# EAGLE design haptic-control (EAGLE 9.3.2)
COMPANY: Tech4Home; CREVISION: v0.1; DESIGNER: Rafael Silva, Joao Silva; LICENSE: Copyright © 2019 Tech4Home; LINK: This file can not be copied and/or distributed without express permission

## Sheet 1 of 4: Power
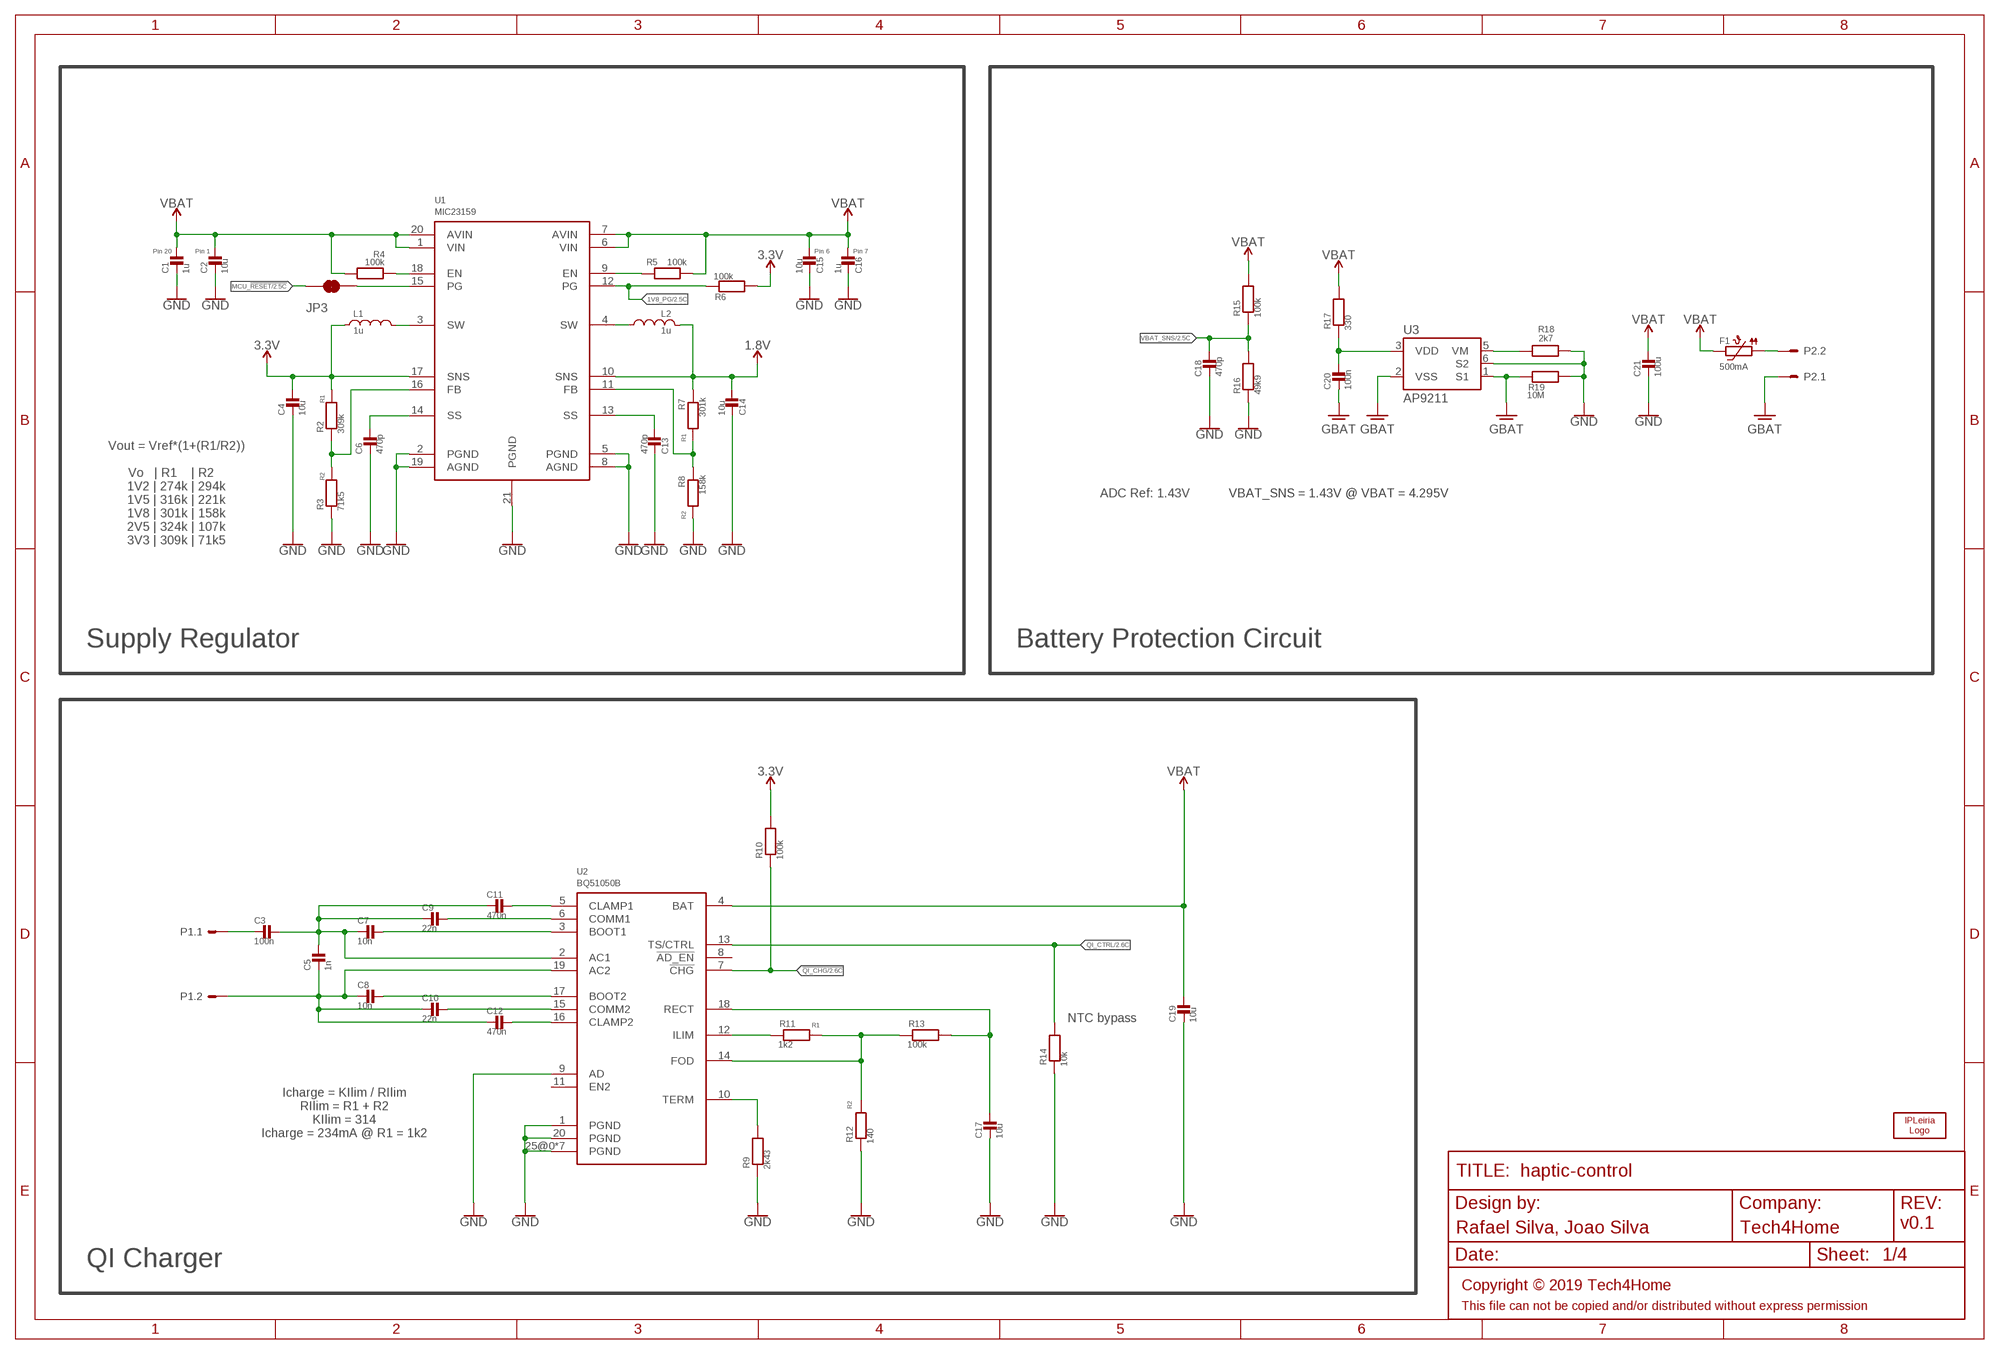
[diagram p0: schematic, sheet 1]

### Parts
C1  1u  MLCC0603  [0603_WAVE]
C2  10u  MLCC0603  [0603_WAVE]
C3  100n  MLCC_0402  [_0402]
C4  10u  MLCC0603  [0603_WAVE]
C5  1n  MLCC_0402  [_0402]
C6  470p  MLCC_0402  [_0402]
C7  10n  MLCC_0402  [_0402]
C8  10n  MLCC_0402  [_0402]
C9  22n  MLCC_0402  [_0402]
C10  22n  MLCC_0402  [_0402]
C11  470n  MLCC_0402  [_0402]
C12  470n  MLCC_0402  [_0402]
C13  470p  MLCC_0402  [_0402]
C14  10u  MLCC0603  [0603_WAVE]
C15  10u  MLCC0603  [0603_WAVE]
C16  1u  MLCC0603  [0603_WAVE]
C17  10u  MLCC0603  [0603_WAVE]
C18  470p  MLCC_0402  [_0402]
C19  10u  MLCC0603  [0603_WAVE]
C20  100n  MLCC_0402  [_0402]
C21  100u  MLCC_1206  [_1206]
F1  500mA  PTC0805  [0805]
JP3  JUMPER-SMT_2_NC_TRACE_SILK  [SMT-JUMPER_2_NC_TRACE_SILK]
L1  1u  INDUCTOR_NC_0806  [_0806]
L2  1u  INDUCTOR_NC_0806  [_0806]
LOGO1  IPL-10MM  [IPL_10MM]
P1  2P-PAD_1X3.5  [PAD1X3_5MM-2P]
P2  2P-PAD_1X3.5  [PAD1X3_5MM-2P]
R2  309k  RESISTOR_0402  [_0402]
R3  71k5  RESISTOR_0402  [_0402]
R4  100k  RESISTOR_0402  [_0402]
R5  100k  RESISTOR_0402  [_0402]
R6  100k  RESISTOR_0402  [_0402]
R7  301k  RESISTOR_0402  [_0402]
R8  158k  RESISTOR_0402  [_0402]
R9  2k43  RESISTOR_0402  [_0402]
R10  100k  RESISTOR_0402  [_0402]
R11  1k2  RESISTOR_0402  [_0402]
R12  140  RESISTOR_0402  [_0402]
R13  100k  RESISTOR_0402  [_0402]
R14  10k  RESISTOR_0402  [_0402]
R15  100k  RESISTOR_0402  [_0402]
R16  49k9  RESISTOR_0402  [_0402]
R17  330  RESISTOR_0402  [_0402]
R18  2k7  RESISTOR_0402  [_0402]
R19  10M  RESISTOR_0402  [_0402]
U1  MIC23159  [VQFN20]
U2  BQ51050B  [VQFN20]
U3  AP9211  [DFN2030-6]

### Nets
1.8V: C14.P$1 L2.1 R7.1 U1.10(SNS) ; also sheet 3
1V8_PG: R6.1 U1.12(PG) ; also sheet 2
3.3V: C4.P$1 L1.1 R2.2 R6.2 R10.2 U1.17(SNS) ; also sheet 2,3,4
!QI_CHG: R10.1 U2.7(!CHG) ; also sheet 2
GBAT: C20.2 P2.1 R19.1 U3.1(S1) U3.2(VSS)
GND: C1.P$2 C2.P$2 C4.P$2 C6.2 C13.2 C14.P$2 C15.P$2 C16.P$2 C17.P$2 C18.2 C19.P$2 C21.2 R3.1 R8.2 R9.1 R12.1 R14.1 R16.1 R18.1 R19.2 U1.2(PGND) U1.5(PGND) U1.8(AGND) U1.19(AGND) U1.21(PGND) U2.1(PGND) U2.9(AD) U2.20(PGND) U2.25@0(PGND) U2.25@1(PGND) U2.25@2(PGND) U2.25@3(PGND) U2.25@4(PGND) U2.25@5(PGND) U2.25@6(PGND) U3.6(S2) ; also sheet 2,3,4
MCU_!RESET: JP3.1 ; also sheet 2
MPU_PWR: R5.1 U1.9(EN)
N$21: R18.2 U3.5(VM)
N$22: F1.1 P2.2
N$23: C20.1 R17.1 U3.3(VDD)
N$25: R2.1 R3.2 U1.16(FB)
N$26: R4.1 U1.18(EN)
N$28: L1.2 U1.3(SW)
N$29: C6.1 U1.14(SS)
N$30: L2.2 U1.4(SW)
N$31: C13.1 U1.13(SS)
N$32: R7.2 R8.1 U1.11(FB)
N$39: R11.2 R12.2 R13.1 U2.14(FOD)
N$40: R11.1 U2.12(ILIM)
N$41: C17.P$1 R13.2 U2.18(RECT)
N$42: R9.2 U2.10(TERM)
N$43: C11.1 U2.5(CLAMP1)
N$44: C9.1 U2.6(COMM1)
N$45: C7.1 U2.3(BOOT1)
N$46: C12.1 U2.16(CLAMP2)
N$47: C10.1 U2.15(COMM2)
N$48: C8.1 U2.17(BOOT2)
N$49: C5.2 C8.2 C10.2 C12.2 P1.2 U2.19(AC2)
N$50: C3.1 C5.1 C7.2 C9.2 C11.2 U2.2(AC1)
N$51: C3.2 P1.1
N$53: JP3.2 U1.15(PG)
QI_CTRL: R14.2 U2.13(TS/CTRL) ; also sheet 2
VBAT: C1.P$1 C2.P$1 C15.P$1 C16.P$1 C19.P$1 C21.1 F1.2 R4.2 R5.2 R15.2 R17.2 U1.1(VIN) U1.6(VIN) U1.7(AVIN) U1.20(AVIN) U2.4(BAT) ; also sheet 4
VBAT_SNS: C18.1 R15.1 R16.2 ; also sheet 2
Unconnected: U2.8(!AD_EN) U2.11(EN2)

### Notes on the sheet
- Pin 20 | Pin 1 | Pin 6 | Pin 7
- R1
- R1
- R2
- Vout = Vref*(1+(R1/R2))
  
   Vo   | R1    | R2    
  1V2 | 274k | 294k
  1V5 | 316k | 221k
  1V8 | 301k | 158k
  2V5 | 324k | 107k
  3V3 | 309k | 71k5
- ADC Ref: 1.43V | VBAT_SNS = 1.43V @ VBAT = 4.295V
- R2
- Supply Regulator | Battery Protection Circuit
- NTC bypass
- R1
- R2
- Icharge = KIlim / RIlim
  RIlim = R1 + R2
  KIlim = 314
  Icharge = 234mA @ R1 = 1k2
- QI Charger

## Sheet 2 of 4: MCU
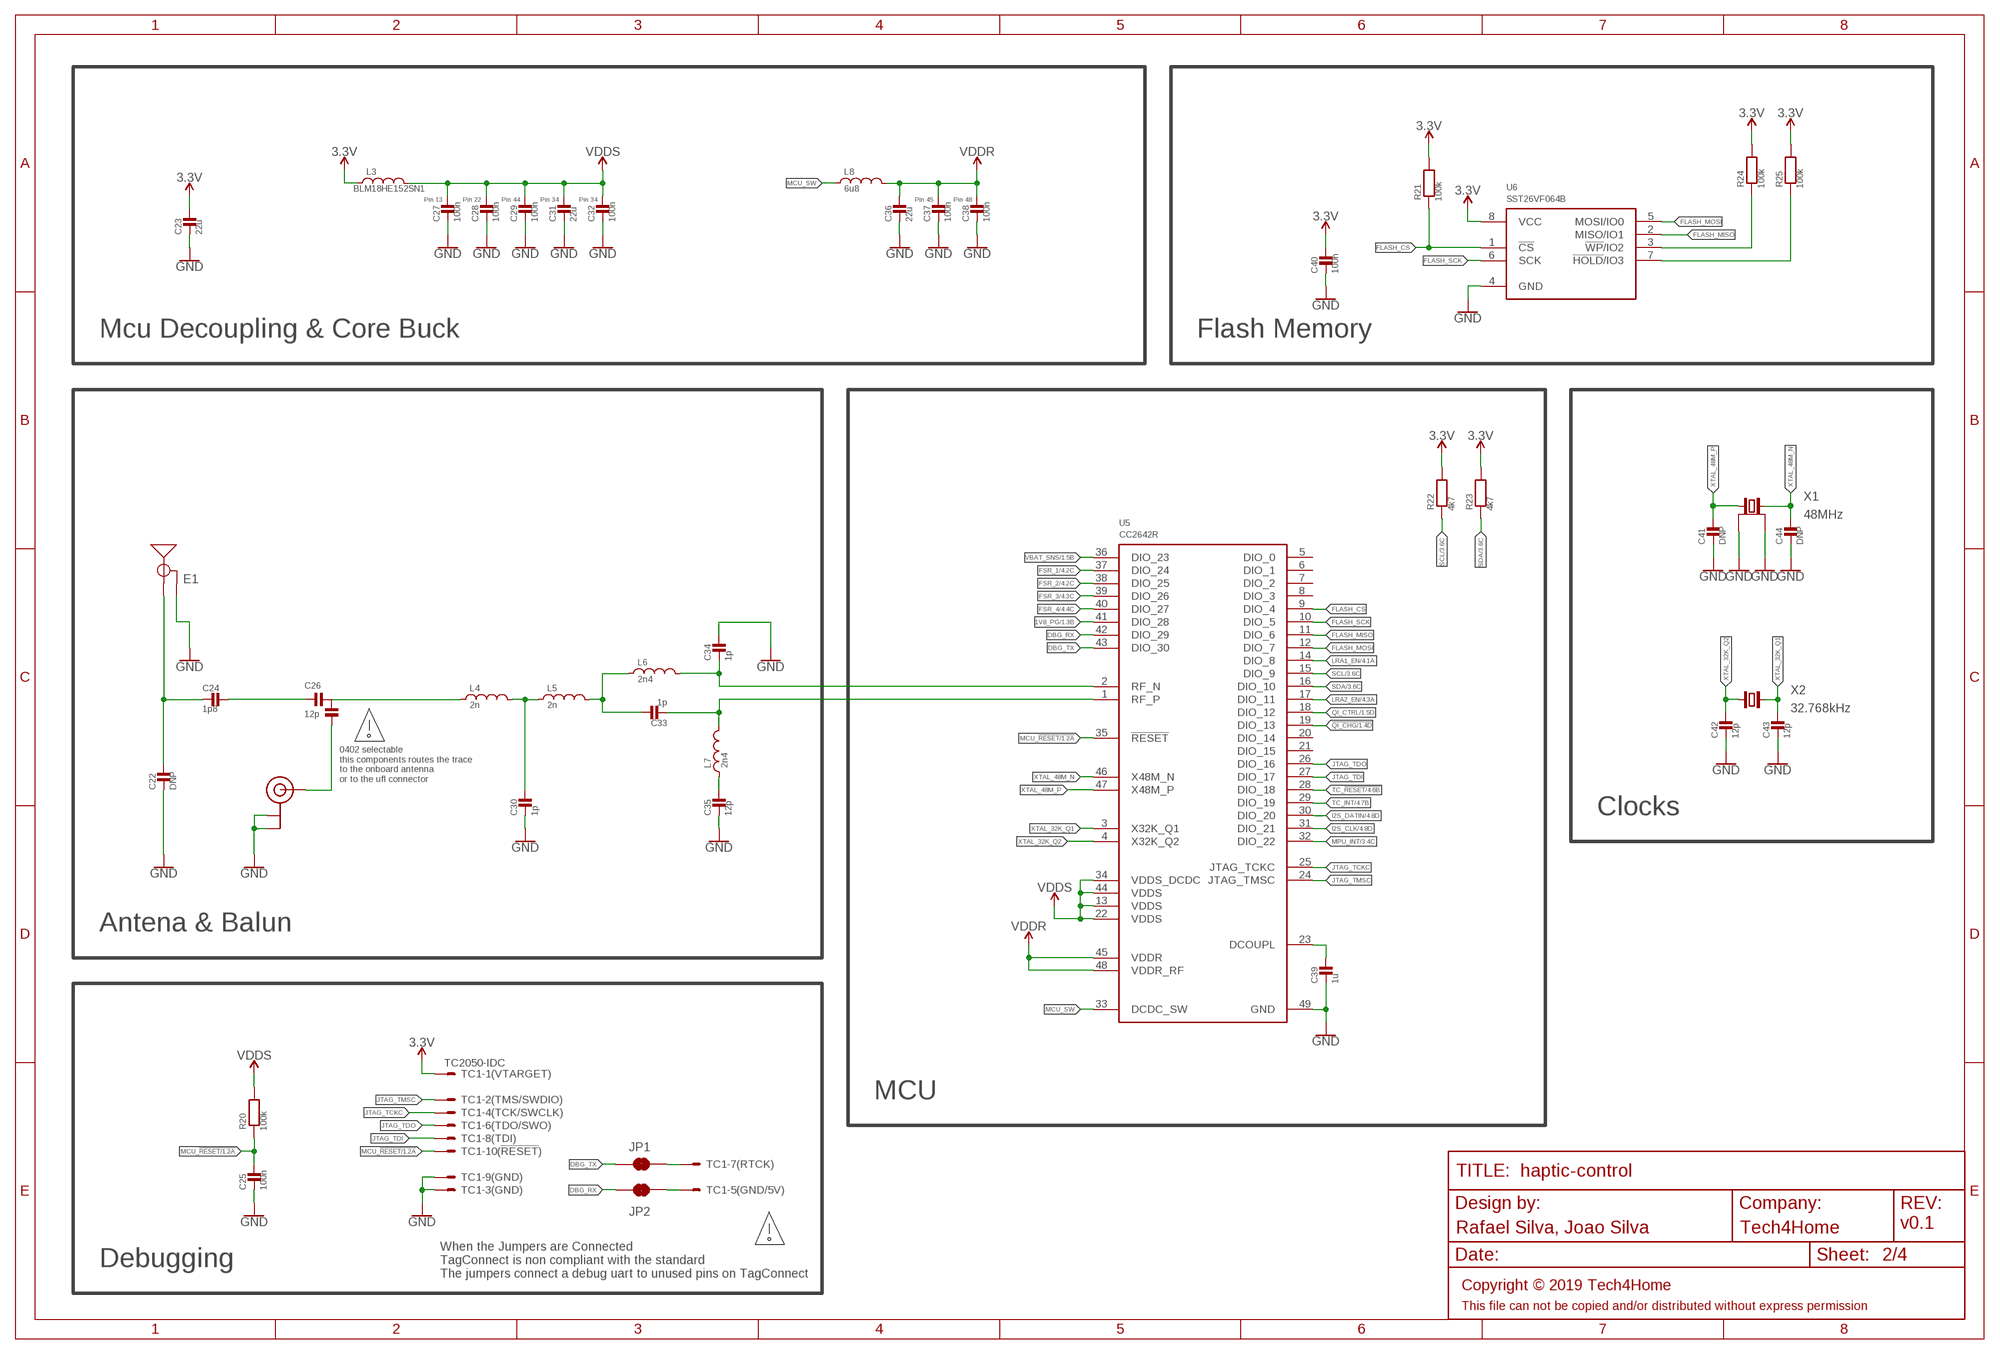
[diagram p1: schematic, sheet 2]

### Parts
A1  U.FL  [U.FL]
C22  DNP  MLCC_0402  [_0402]
C23  22u  MLCC0603  [0603_WAVE]
C24  1p8  MLCC_0402  [_0402]
C25  100n  MLCC_0402  [_0402]
C26  12p  MLCC_SEL  [_0402_SEL]
C27  100n  MLCC_0402  [_0402]
C28  100n  MLCC_0402  [_0402]
C29  100n  MLCC_0402  [_0402]
C30  1p  MLCC_0402  [_0402]
C31  22u  MLCC0603  [0603_WAVE]
C32  100n  MLCC_0402  [_0402]
C33  1p  MLCC_0402  [_0402]
C34  1p  MLCC_0402  [_0402]
C35  12p  MLCC_0402  [_0402]
C36  22u  MLCC0603  [0603_WAVE]
C37  100n  MLCC_0402  [_0402]
C38  100n  MLCC_0402  [_0402]
C39  1u  MLCC0603  [0603_WAVE]
C40  100n  MLCC_0402  [_0402]
C41  DNP  MLCC_0402  [_0402]
C42  12p  MLCC_0402  [_0402]
C43  12p  MLCC_0402  [_0402]
C44  DNP  MLCC_0402  [_0402]
E1  2.4GHZTRACE-15.2MM  [TRACE_ANTENNA_2.4GHZ_15.2MM]
JP1  JUMPER-SMT_2_NC_TRACE_SILK  [SMT-JUMPER_2_NC_TRACE_SILK]
JP2  JUMPER-SMT_2_NC_TRACE_SILK  [SMT-JUMPER_2_NC_TRACE_SILK]
L3  BLM18HE152SN1  INDUCTOR_NC_0603  [_0603]
L4  2n  INDUCTOR_NC_0402  [_0402]
L5  2n  INDUCTOR_NC_0402  [_0402]
L6  2n4  INDUCTOR_NC_0402  [_0402]
L7  2n4  INDUCTOR_NC_0402  [_0402]
L8  6u8  INDUCTOR_NC_0806  [_0806]
R20  100k  RESISTOR_0402  [_0402]
R21  100k  RESISTOR_0402  [_0402]
R22  4k7  RESISTOR_0402  [_0402]
R23  4k7  RESISTOR_0402  [_0402]
R24  100k  RESISTOR_0402  [_0402]
R25  100k  RESISTOR_0402  [_0402]
TC1  TC2050-IDC  [TC2050-IDC]
U5  CC2642R  [QFN48]
U6  SST26VF064B  [WSOIC8]
X1  48MHz  CRYSTAL_4P  [4-SMD-3225]
X2  32.768kHz  CRYSTAL2-SMD-3215  [2-SMD-3215]

### Nets
1V8_PG: U5.41(DIO_28) ; also sheet 1
3.3V: C23.P$1 C40.1 L3.1 R21.2 R22.2 R23.2 R24.2 R25.2 TC1.1 U6.8(VCC) ; also sheet 1,3,4
!QI_CHG: U5.19(DIO_13) ; also sheet 1
DBG_RX: JP2.1 U5.42(DIO_29)
DBG_TX: JP1.1 U5.43(DIO_30)
FLASH_CS: R21.1 U5.9(DIO_4) U6.1(!CS!)
FLASH_MISO: U5.11(DIO_6) U6.2(MISO/IO1)
FLASH_MOSI: U5.12(DIO_7) U6.5(MOSI/IO0)
FLASH_SCK: U5.10(DIO_5) U6.6(SCK)
FSR_1: U5.37(DIO_24) ; also sheet 4
FSR_2: U5.38(DIO_25) ; also sheet 4
FSR_3: U5.39(DIO_26) ; also sheet 4
FSR_4: U5.40(DIO_27) ; also sheet 4
GND: A1.P$1(GND) A1.P$2(GND) C22.2 C23.P$2 C25.2 C27.2 C28.2 C29.2 C30.2 C31.P$2 C32.2 C34.1 C35.2 C36.P$2 C37.2 C38.2 C39.P$2 C40.2 C41.2 C42.2 C43.2 C44.2 E1.GND TC1.3 TC1.9 U5.49(GND) U6.4(GND) X1.2(GND) X1.4(GND) ; also sheet 1,3,4
I2S_CLK: U5.31(DIO_21) ; also sheet 4
I2S_DATIN: U5.30(DIO_20) ; also sheet 4
JTAG_TCKC: TC1.4 U5.25(JTAG_TCKC)
JTAG_TDI: TC1.8 U5.27(DIO_17)
JTAG_TDO: TC1.6 U5.26(DIO_16)
JTAG_TMSC: TC1.2 U5.24(JTAG_TMSC)
LRA1_EN: U5.14(DIO_8) ; also sheet 4
LRA2_EN: U5.17(DIO_11) ; also sheet 4
MCU_!RESET: C25.1 R20.1 TC1.10 U5.35(!RESET) ; also sheet 1
MCU_SW: L8.1 U5.33(DCDC_SW)
MPU_INT: U5.32(DIO_22) ; also sheet 3
N$1: C34.2 L6.2 U5.2(RF_N)
N$2: C39.P$1 U5.23(DCOUPL)
N$3: C33.2 L7.2 U5.1(RF_P)
N$7: R24.1 U6.3(!WP!/IO2)
N$8: R25.1 U6.7(!HOLD!/IO3)
N$12: C26.1(I) L4.1
N$13: C24.1 C26.3(O2)
N$14: C35.1 L7.1
N$15: C33.1 L5.2 L6.1
N$16: C30.1 L4.2 L5.1
N$17: C22.1 C24.2 E1.ANT(SIGNAL)
N$18: A1.P$3(SIGNAL) C26.2(O1)
N$19: JP2.2 TC1.5
N$20: JP1.2 TC1.7
QI_CTRL: U5.18(DIO_12) ; also sheet 1
SCL: R22.1 U5.15(DIO_9) ; also sheet 3,4
SDA: R23.1 U5.16(DIO_10) ; also sheet 3,4
TC_!RESET: U5.28(DIO_18) ; also sheet 4
TC_INT: U5.29(DIO_19) ; also sheet 4
VBAT_SNS: U5.36(DIO_23) ; also sheet 1
VDDR: C36.P$1 C37.1 C38.1 L8.2 U5.45(VDDR) U5.48(VDDR_RF)
VDDS: C27.1 C28.1 C29.1 C31.P$1 C32.1 L3.2 R20.2 U5.13(VDDS) U5.22(VDDS) U5.34(VDDS_DCDC) U5.44(VDDS)
XTAL_32K_Q1: C43.1 U5.3(X32K_Q1) X2.2
XTAL_32K_Q2: C42.1 U5.4(X32K_Q2) X2.1
XTAL_48M_N: C44.1 U5.46(X48M_N) X1.3
XTAL_48M_P: C41.1 U5.47(X48M_P) X1.1
Unconnected: U5.5(DIO_0) U5.6(DIO_1) U5.7(DIO_2) U5.8(DIO_3) U5.20(DIO_14) U5.21(DIO_15)

### Notes on the sheet
- Pin 13 | Pin 22 | Pin 44 | Pin 34 | Pin 34 | Pin 45 | Pin 48
- Mcu Decoupling & Core Buck | Flash Memory
- 0402 selectable
  this components routes the trace 
  to the onboard antenna 
  or to the ufl connector
- Clocks
- Antena & Balun
- MCU
- Debugging
- When the Jumpers are Connected
  TagConnect is non compliant with the standard
  The jumpers connect a debug uart to unused pins on TagConnect

## Sheet 3 of 4: MPU
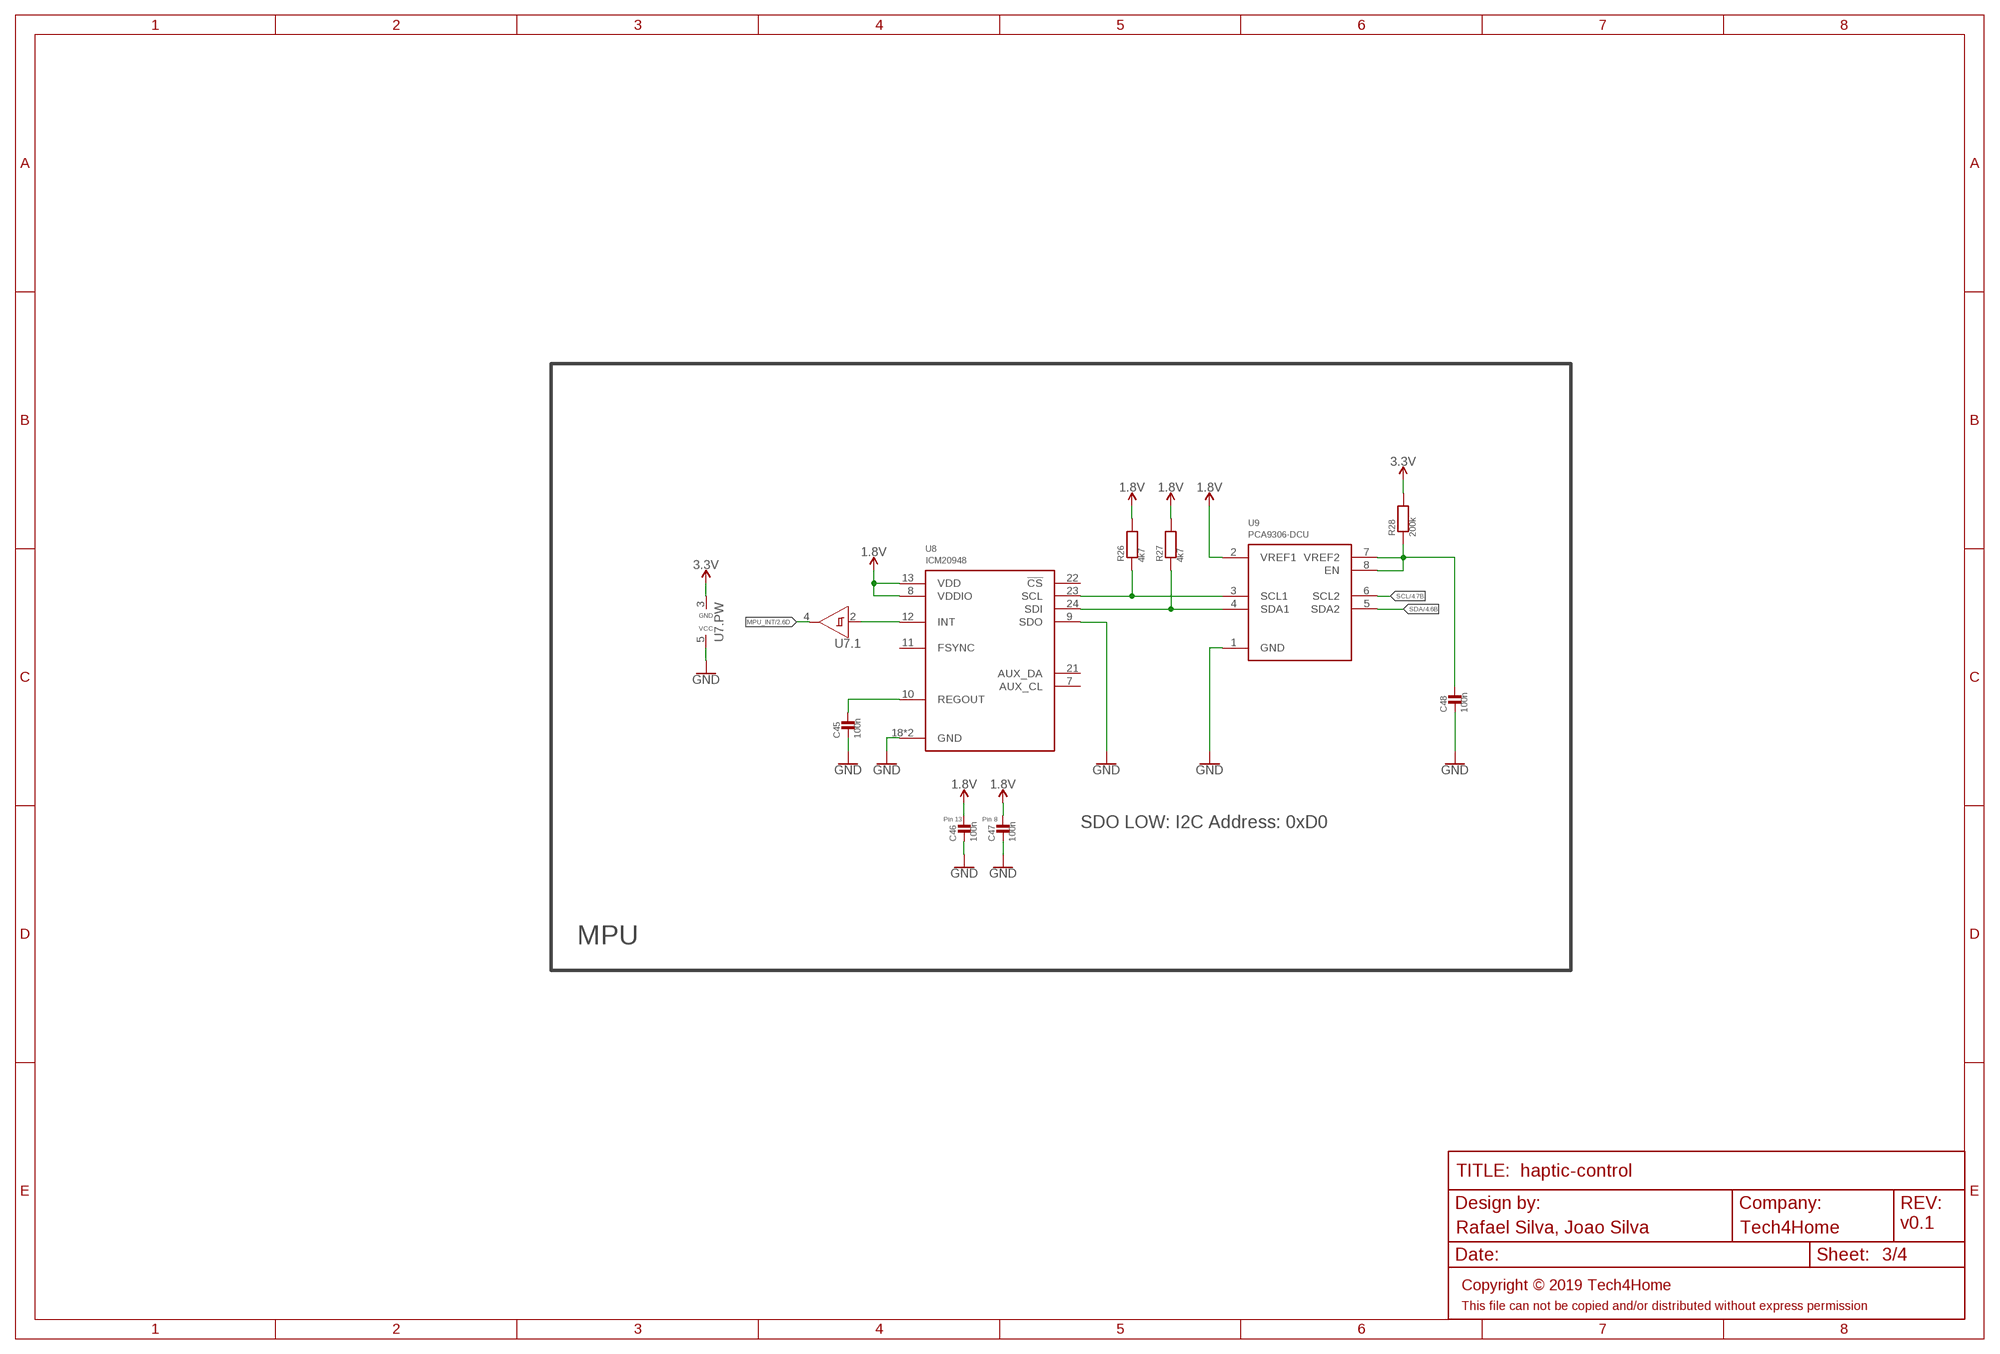
[diagram p2: schematic, sheet 3]

### Parts
C45  100n  MLCC_0402  [_0402]
C46  100n  MLCC_0402  [_0402]
C47  100n  MLCC_0402  [_0402]
C48  100n  MLCC_0402  [_0402]
R26  4k7  RESISTOR_0402  [_0402]
R27  4k7  RESISTOR_0402  [_0402]
R28  200k  RESISTOR_0402  [_0402]
U7  74LVC1G17  [SC70-5]
U8  ICM20948  [QFN20]
U9  PCA9306-DCU  [VSSOP8]

### Nets
1.8V: C46.1 C47.1 R26.2 R27.2 U8.8(VDDIO) U8.13(VDD) U9.2(VREF1) ; also sheet 1
3.3V: R28.2 U7.3(.PW:GND) ; also sheet 1,2,4
GND: C45.2 C46.2 C47.2 C48.2 U7.5(.PW:VCC) U8.9(SDO) U8.18(GND) U8.20(GND) U9.1(GND) ; also sheet 1,2,4
MPU_INT: U7.4(.1:Y) ; also sheet 2
N$4: U7.2(.1:A) U8.12(INT)
N$5: R26.1 U8.23(SCL) U9.3(SCL1)
N$6: R27.1 U8.24(SDI) U9.4(SDA1)
N$9: C45.1 U8.10(REGOUT)
N$11: C48.1 R28.1 U9.7(VREF2) U9.8(EN)
SCL: U9.6(SCL2) ; also sheet 2,4
SDA: U9.5(SDA2) ; also sheet 2,4
Unconnected: U8.7(AUX_CL) U8.11(FSYNC) U8.21(AUX_DA) U8.22(!CS)

### Notes on the sheet
- Pin 13 | Pin 8
- SDO LOW: I2C Address: 0xD0
- MPU

## Sheet 4 of 4: Interface
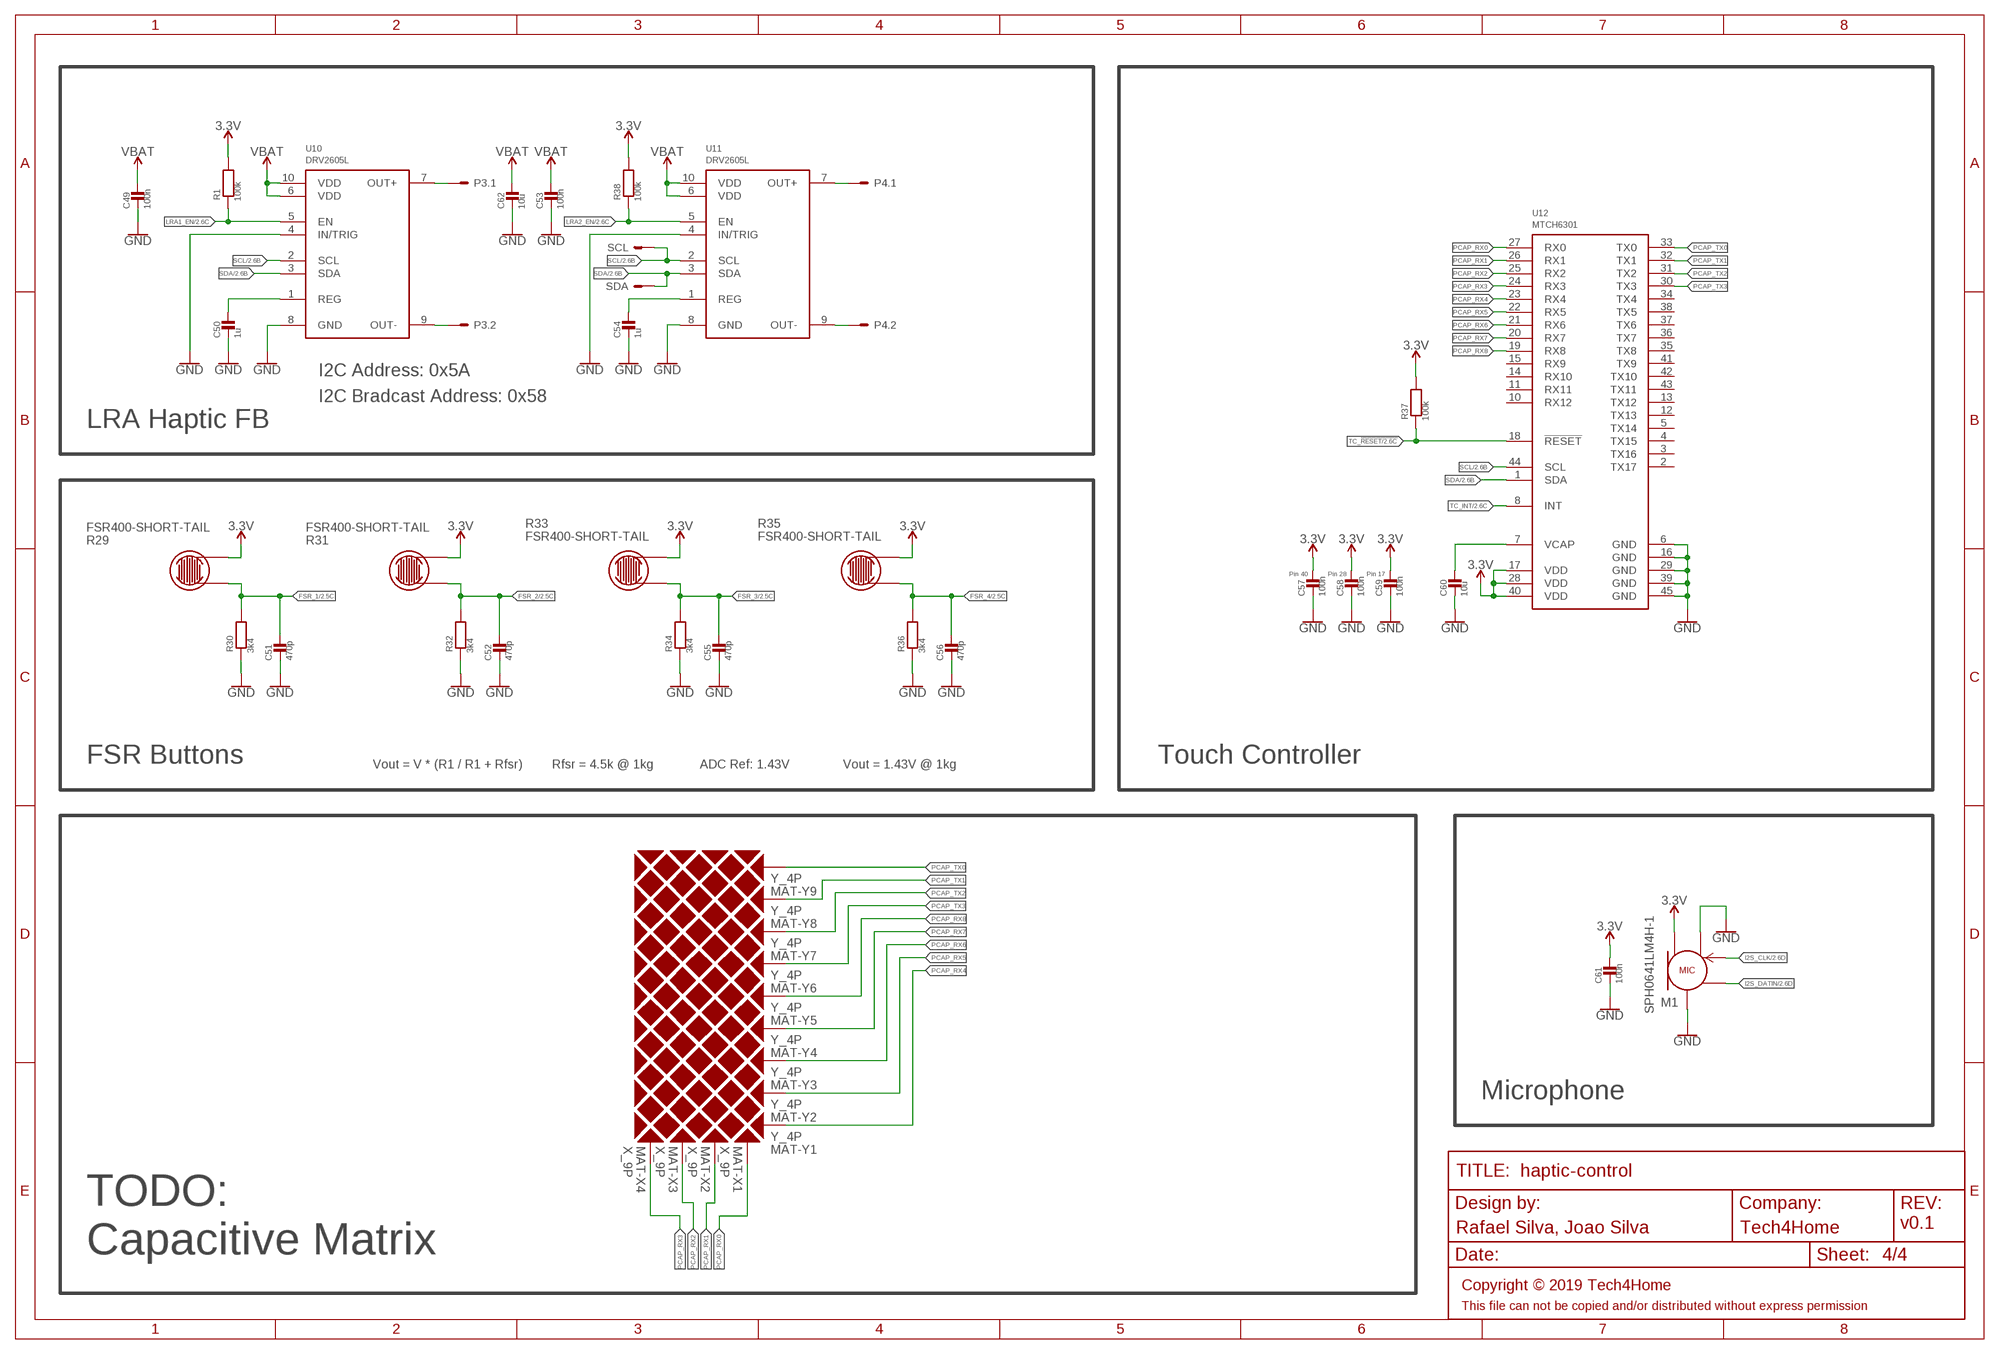
[diagram p3: schematic, sheet 4]

### Parts
C49  100n  MLCC_0402  [_0402]
C50  1u  MLCC0603  [0603_WAVE]
C51  470p  MLCC_0402  [_0402]
C52  470p  MLCC_0402  [_0402]
C53  100n  MLCC_0402  [_0402]
C54  1u  MLCC0603  [0603_WAVE]
C55  470p  MLCC_0402  [_0402]
C56  470p  MLCC_0402  [_0402]
C57  100n  MLCC_0402  [_0402]
C58  100n  MLCC_0402  [_0402]
C59  100n  MLCC_0402  [_0402]
C60  10u  MLCC0603  [0603_WAVE]
C61  100n  MLCC_0402  [_0402]
C62  10u  MLCC0603  [0603_WAVE]
M1  SPH0641LM4H-1  [SPH0641LM4H-1]
MAT-X1  X_9P  [TOUCH_X_9P]
MAT-X2  X_9P  [TOUCH_X_9P]
MAT-X3  X_9P  [TOUCH_X_9P]
MAT-X4  X_9P  [TOUCH_X_9P]
MAT-Y1  Y_4P  [TOUCH_Y_4P]
MAT-Y2  Y_4P  [TOUCH_Y_4P]
MAT-Y3  Y_4P  [TOUCH_Y_4P]
MAT-Y4  Y_4P  [TOUCH_Y_4P]
MAT-Y5  Y_4P  [TOUCH_Y_4P]
MAT-Y6  Y_4P  [TOUCH_Y_4P]
MAT-Y7  Y_4P  [TOUCH_Y_4P]
MAT-Y8  Y_4P  [TOUCH_Y_4P]
MAT-Y9  Y_4P  [TOUCH_Y_4P]
P3  2P-PAD_1X3.5  [PAD1X3_5MM-2P]
P4  2P-PAD_1X3.5  [PAD1X3_5MM-2P]
R1  100k  RESISTOR_0402  [_0402]
R29  FSR400-SHORT-TAIL  [FSR400-SHORT-TAIL]
R30  3k4  RESISTOR_0402  [_0402]
R31  FSR400-SHORT-TAIL  [FSR400-SHORT-TAIL]
R32  3k4  RESISTOR_0402  [_0402]
R33  FSR400-SHORT-TAIL  [FSR400-SHORT-TAIL]
R34  3k4  RESISTOR_0402  [_0402]
R35  FSR400-SHORT-TAIL  [FSR400-SHORT-TAIL]
R36  3k4  RESISTOR_0402  [_0402]
R37  100k  RESISTOR_0402  [_0402]
R38  100k  RESISTOR_0402  [_0402]
SCL  TEST_POINT  [TEST_POINT]
SDA  TEST_POINT  [TEST_POINT]
U10  DRV2605L  [VSSOP10]
U11  DRV2605L  [VSSOP10]
U12  MTCH6301  [QFN44]

### Nets
3.3V: C57.1 C58.1 C59.1 C61.1 M1.5(VCC) R1.2 R29.2 R31.2 R33.1 R35.1 R37.2 R38.2 U12.17(VDD) U12.28(VDD) U12.40(VDD) ; also sheet 1,2,3
FSR_1: C51.1 R29.1 R30.2 ; also sheet 2
FSR_2: C52.1 R31.1 R32.2 ; also sheet 2
FSR_3: C55.1 R33.2 R34.2 ; also sheet 2
FSR_4: C56.1 R35.2 R36.2 ; also sheet 2
GND: C49.2 C50.P$2 C51.2 C52.2 C53.2 C54.P$2 C55.2 C56.2 C57.2 C58.2 C59.2 C60.P$2 C61.2 C62.P$2 M1.2(SEL) M1.3(GND) R30.1 R32.1 R34.1 R36.1 U10.4(IN/TRIG) U10.8(GND) U11.4(IN/TRIG) U11.8(GND) U12.6(GND) U12.16(GND) U12.29(GND) U12.39(GND) U12.45(GND) ; also sheet 1,2,3
I2S_CLK: M1.4(CLK) ; also sheet 2
I2S_DATIN: M1.1(DAT) ; also sheet 2
LRA1_EN: R1.1 U10.5(EN) ; also sheet 2
LRA2_EN: R38.1 U11.5(EN) ; also sheet 2
N$10: C60.P$1 U12.7(VCAP)
N$27: P3.1 U10.7(OUT+)
N$33: P3.2 U10.9(OUT-)
N$34: P4.1 U11.7(OUT+)
N$35: P4.2 U11.9(OUT-)
N$36: C50.P$1 U10.1(REG)
N$37: C54.P$1 U11.1(REG)
PCAP_RX0: MAT-X1.P$2 U12.27(RX0)
PCAP_RX1: MAT-X2.P$2 U12.26(RX1)
PCAP_RX2: MAT-X3.P$2 U12.25(RX2)
PCAP_RX3: MAT-X4.P$2 U12.24(RX3)
PCAP_RX4: MAT-Y1.P$2 MAT-Y1.P$3 MAT-Y1.P$4 MAT-Y1.P$5 MAT-Y1.P$8 U12.23(RX4)
PCAP_RX5: MAT-Y2.P$2 MAT-Y2.P$3 MAT-Y2.P$4 MAT-Y2.P$5 MAT-Y2.P$8 U12.22(RX5)
PCAP_RX6: MAT-Y3.P$2 MAT-Y3.P$3 MAT-Y3.P$4 MAT-Y3.P$5 MAT-Y3.P$8 U12.21(RX6)
PCAP_RX7: MAT-Y4.P$2 MAT-Y4.P$3 MAT-Y4.P$4 MAT-Y4.P$5 MAT-Y4.P$8 U12.20(RX7)
PCAP_RX8: MAT-Y5.P$2 MAT-Y5.P$3 MAT-Y5.P$4 MAT-Y5.P$5 MAT-Y5.P$8 U12.19(RX8)
PCAP_TX0: MAT-Y9.P$2 MAT-Y9.P$3 MAT-Y9.P$4 MAT-Y9.P$5 MAT-Y9.P$8 U12.33(TX0)
PCAP_TX1: MAT-Y8.P$2 MAT-Y8.P$3 MAT-Y8.P$4 MAT-Y8.P$5 MAT-Y8.P$8 U12.32(TX1)
PCAP_TX2: MAT-Y7.P$2 MAT-Y7.P$3 MAT-Y7.P$4 MAT-Y7.P$5 MAT-Y7.P$8 U12.31(TX2)
PCAP_TX3: MAT-Y6.P$2 MAT-Y6.P$3 MAT-Y6.P$4 MAT-Y6.P$5 MAT-Y6.P$8 U12.30(TX3)
SCL: SCL.1(S) U10.2(SCL) U11.2(SCL) U12.44(SCL) ; also sheet 2,3
SDA: SDA.1(S) U10.3(SDA) U11.3(SDA) U12.1(SDA) ; also sheet 2,3
TC_!RESET: R37.1 U12.18(!RESET) ; also sheet 2
TC_INT: U12.8(INT) ; also sheet 2
VBAT: C49.1 C53.1 C62.P$1 U10.6(VDD) U10.10(VDD) U11.6(VDD) U11.10(VDD) ; also sheet 1
Unconnected: U12.2(TX17) U12.3(TX16) U12.4(TX15) U12.5(TX14) U12.10(RX12) U12.11(RX11) U12.12(TX13) U12.13(TX12) U12.14(RX10) U12.15(RX9) U12.34(TX4) U12.35(TX8) U12.36(TX7) U12.37(TX6) U12.38(TX5) U12.41(TX9) U12.42(TX10) U12.43(TX11)

### Notes on the sheet
- I2C Address: 0x5A
- I2C Bradcast Address: 0x58
- LRA Haptic FB
- Pin 40 | Pin 28 | Pin 17
- FSR Buttons | Vout = V * (R1 / R1 + Rfsr) | Rfsr = 4.5k @ 1kg | ADC Ref: 1.43V | Vout = 1.43V @ 1kg | Touch Controller
- Microphone
- TODO:
  Capacitive Matrix

## Library data of the parts
A1 = Connectors > Antennas:U.FL
C1-C25 C27-C62 = Passive Components > Capacitors > Multilayer Ceramic Capacitors MLCC:MLCC: KEMET’s X7R dielectric features a 125°C maximum operating temperature and is considered temperature stable. The Electronics Components, Assemblies and Materials Association (EIA) characterizes X7R dielectric as a Class II material. Components of this classification are fixed, ceramic dielectric capacitors suited for bypass and decoupling applications or for frequency discriminating circuits where Q and stability of capacitance characteristics are not critical. X7R exhibits a predictable change in capacitance with respect to time and voltage, boasting a minimal change in capacitance with reference to ambient temperature. Capacitance change is limited to ±15% from −55°C to +125°C.
C26 = Passive Components > Capacitors > Multilayer Ceramic Capacitors MLCC:MLCC_SEL
E1 = Microstrip Antenna:2.4GHZ: Chip antenna Chip antenna with ground or secondary connection. Common with larger metal RF connectors.
F1 = PTC Fuses:PTC
JP1-JP3 = Utility > Board:JUMPER-SMT_2_NC_TRACE: Normally closed trace jumper This jumper has a trace between two pads so it's normally closed (NC). Use a razor knife to open the connection. For best results follow the IPC guidelines for cutting traces: Cutout at least 0.063 mm (0.005 in). Remove all loose material to clean up the cut area. Seal the cut with an approved epoxy. Reapply solder to reclose the connection.
L1-L8 = Passive Components > Inductors, Chokes & Coils:INDUCTOR_NC
LOGO1 = Silkscreen:IPL
M1 = Knowles:SPH0641LM4H-1
MAT-X1-MAT-X4 = Touch Panel:X_9P
MAT-Y1-MAT-Y9 = Touch Panel:Y_4P
P1-P4 = Connectors > Other:2P-PAD
R1-R28 R30 R32 R34 R36-R38 = Passive Components > Resistors > Chip Resistors:RESISTOR: Resistors For new designs, use the packages preceded by an '_' character since they are more reliable: The following footprints should be used on most boards: _0402 - Standard footprint for regular board layouts _0603 - Standard footprint for regular board layouts _0805 - Standard footprint for regular board layouts _1206 - Standard footprint for regular board layouts For extremely tight-pitch boards where space is at a premium, the following 'micro-pitch' footprints can be used (smaller pads, no silkscreen outline, etc.): _0402MP - Micro-pitch footprint for very dense/compact boards _0603MP - Micro-pitch footprint for very dense/compact boards _0805MP - Micro-pitch footprint for very dense/compact boards _1206MP - Micro-pitch footprint for very dense/compact boards
R29 R31 R33 R35 = Interlink:FSR400
SCL SDA = Utility > Board:TEST_POINT
TC1 = TagConnect:TC2050-IDC
U1 = Microchip:MIC23159
U2 = Texas Instruments:BQ51050B
U3 = Power > Battery Management:AP9211
U5 = Texas Instruments:CC2642R
U6 = Microchip:SST26VF064B
U7 = Semiconductors > Integrated Circuits - ICs > Logic ICs > Logic Gates:74LVC1G17
U8 = TDK:ICM20948
U9 = Texas Instruments:PCA9306
U10 U11 = Texas Instruments:DRV2605L
U12 = Microchip:MTCH6301
X1 = Crystal:CRYSTAL_4P
X2 = Crystal:CRYSTAL

## Board
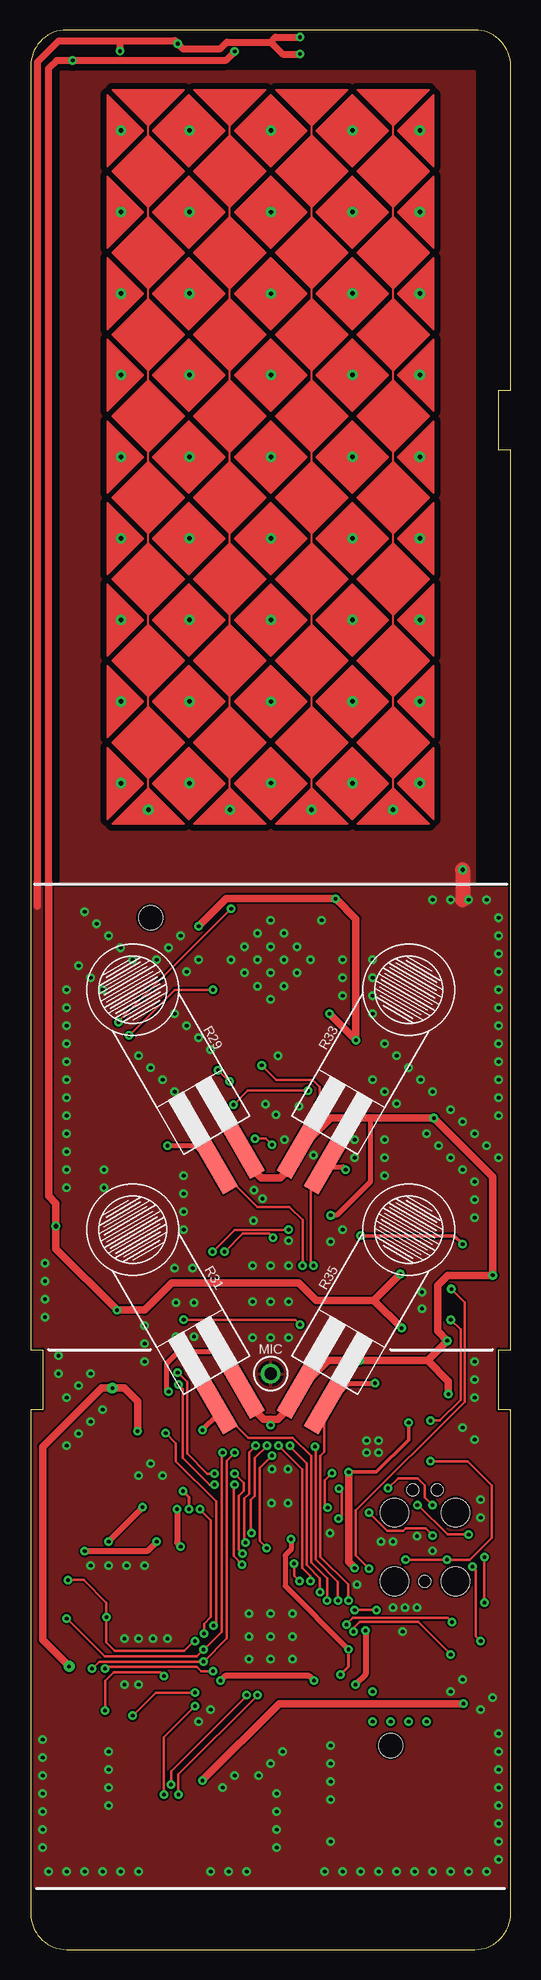
[diagram p4: board, top side]
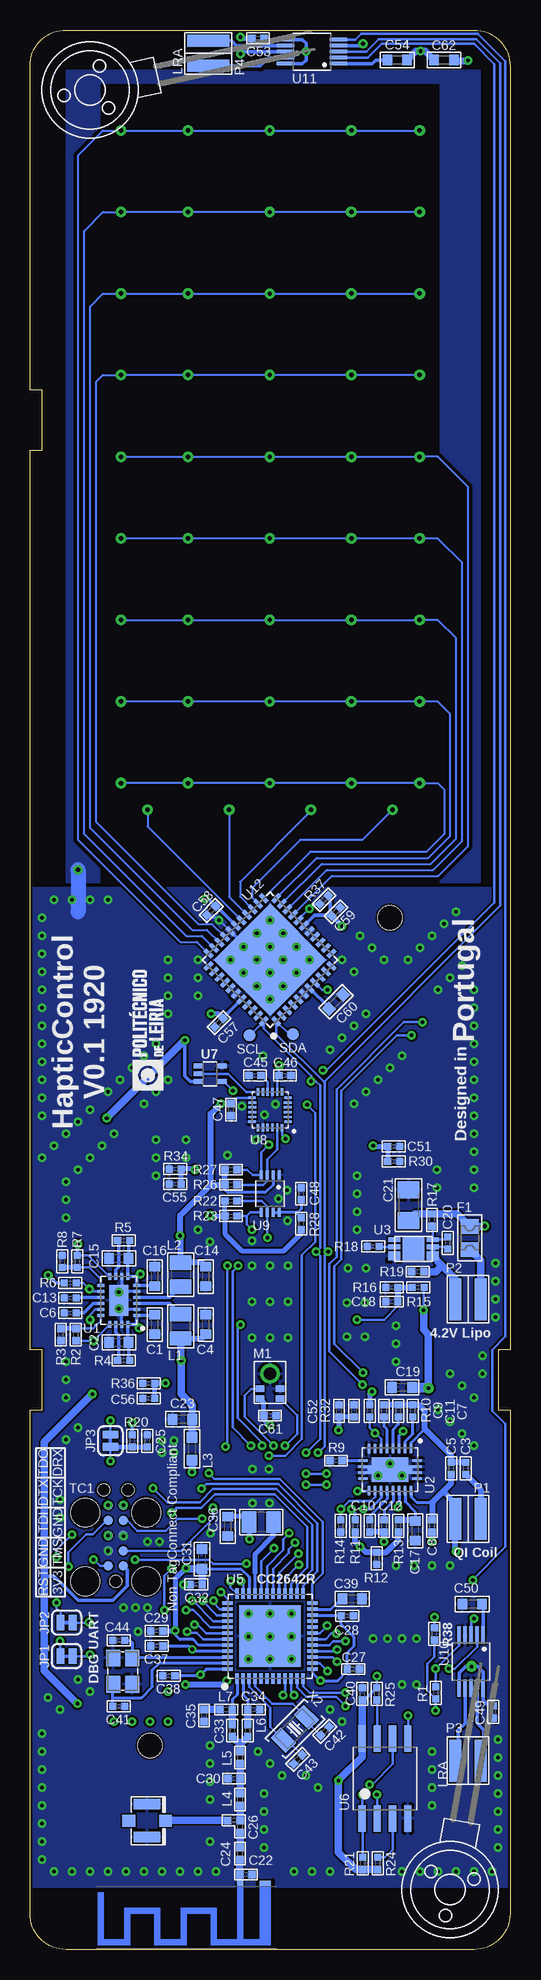
[diagram p5: board, bottom side, seen from below]

Size 40 x 160 mm. Coordinates in mm from the lower left corner, seen from the top.
Outline: 0,157 0,50 1,50 1,45 0,45 0,3 arc90 3,0 37,0 arc90 40,3 40,45 39,45 39,50 40,50 40,125 39,125 39,130 40,130 40,157 arc90 37,160 3,160 arc90 0,157
Copper layers (1*16): Top 0.035mm / dielectric 1.6mm / Bottom 0.035mm
Design rules "jlcpcb-dr *": minimum track width 5mil, minimum drill 0.3mm, track to track 5mil, track to pad 5mil, pad to pad 5mil, via to via 5mil, smd to smd 5mil, copper to edge 0.2mm, drill to drill 5mil, minimum pad ring 10mil, minimum via ring 8mil, stop-mask expansion 4mil, vias tented up to drill 0.7mm, thermal gap 10mil
Holes 2 mm at 30,17 10,86

### Footprints (pad centres in the part's own frame; a part is rotated, then mirrored left to right if it is on the bottom)
U.FL = smd 2.2 x 0.85: P$1 0,1.375; P$2 0,-1.375 | smd 1.05 x 1: P$3 1.525,0; P$4 -1.525,0
0603_WAVE = smd 0.8 x 0.9: P$1 -0.823,0; P$2 0.823,0
_0402 = smd 0.6 x 0.6: 1 -0.508,0; 2 0.508,0
_1206 = smd 1.4 x 1.8: 1 -1.27,0; 2 1.27,0
_0402_SEL = smd 0.6 x 0.6: 1 -0.508,0; 2 -0.508,-1.016; 3 0.508,0
TRACE_ANTENNA_2.4GHZ_15.2MM = smd 0.5 x 0.5: ANT 0,-0.25 | smd 0.9 x 0.5: GND -2.1,-0.25
0805 = smd 1.245 x 1.473: 1 -0.965,0; 2 0.965,0
SMT-JUMPER_2_NC_TRACE_SILK = smd 0.635 x 1.27: 1 -0.508,0; 2 0.508,0
_0806 = smd 1.2 x 1.8: 1 -1.016,0; 2 1.016,0
_0603 = smd 0.9 x 0.9: 1 -0.95,0; 2 0.95,0
SPH0641LM4H-1 = smd 0.725 x 0.522: 1 -0.838,2.074; 2 -0.838,1.252; 4 0.838,1.252; 5 0.838,2.074 | drill 1.025 pad 1.625: 3 0,0
TOUCH_X_9P = drill 0.38 pad 0.79: P$2 0,29.4
TOUCH_Y_4P = drill 0.38 pad 0.79: P$2 -12.4,0; P$3 -6.8,0; P$5 6.8,0; P$8 12.5,0 | drill 0.35 pad 0.79: P$4 0,0
PAD1X3_5MM-2P = smd 1 x 3.5: 1 -1.046,0; 2 1.046,0
FSR400-SHORT-TAIL = smd 1.4 x 4.5: 1 -1.3,-16.3; 2 1.3,-16.3
TEST_POINT = smd 1 x 1: 1 0,0
TC2050-IDC = smd 0.787 x 0.787: 1 -2.54,-0.635; 2 -1.27,-0.635; 3 0,-0.635; 4 1.27,-0.635; 5 2.54,-0.635; 6 2.54,0.635; 7 1.27,0.635; 8 0,0.635; 9 -1.27,0.635; 10 -2.54,0.635 | hole 0.991: -3.81,0; 3.81,1.016; 3.81,-1.016 | hole 2.375: -3.81,2.54; -3.81,-2.54; 1.905,2.54; 1.905,-2.54
VQFN20 = smd 0.6 x 0.25: 1 -1.5,1.25; 2 -1.5,0.75; 3 -1.5,0.25; 4 -1.5,-0.25; 5 -1.5,-0.75; 6 -1.5,-1.25; 11 1.5,-1.25; 12 1.5,-0.75; 13 1.5,-0.25; 14 1.5,0.25; 15 1.5,0.75; 16 1.5,1.25 | smd 0.25 x 0.6: 7 -0.75,-2; 8 -0.25,-2; 9 0.25,-2; 10 0.75,-2; 17 0.75,2; 18 0.25,2; 19 -0.25,2; 20 -0.75,2 | smd 1.6 x 2.6: 21 0,0
VQFN20' = smd 0.24 x 0.8: 1 -0.75,2.25; 10 -0.75,-2.25; 11 0.75,-2.25; 20 0.75,2.25; 25@3 -0.25,-2.25; 25@4 0.25,-2.25; 25@5 0.25,2.25; 25@6 -0.25,2.25 | smd 0.8 x 0.24: 2 -1.75,1.75; 3 -1.75,1.25; 4 -1.75,0.75; 5 -1.75,0.25; 6 -1.75,-0.25; 7 -1.75,-0.75; 8 -1.75,-1.25; 9 -1.75,-1.75; 12 1.75,-1.75; 13 1.75,-1.25; 14 1.75,-0.75; 15 1.75,-0.25; 16 1.75,0.25; 17 1.75,0.75; 18 1.75,1.25; 19 1.75,1.75 | smd 2.05 x 3.05: 25@0 0,0 | smd 0.74 x 0.33: 25@1 0,-1.688; 25@2 0,1.688
DFN2030-6 = smd 1 x 0.75: 1 -1.6,0.6; 6 1.6,0.6 | smd 1 x 0.4: 2 -1.6,-0.175; 3 -1.6,-0.775; 4 1.6,-0.775; 5 1.6,-0.175 | smd 1.8 x 1.9: EP 0,0
QFN48 = smd 0.86 x 0.26: 1 -3.53,2.75; 2 -3.53,2.25; 3 -3.53,1.75; 4 -3.53,1.25; 5 -3.53,0.75; 6 -3.53,0.25; 7 -3.53,-0.25; 8 -3.53,-0.75; 9 -3.53,-1.25; 10 -3.53,-1.75; 11 -3.53,-2.25; 12 -3.53,-2.75; 25 3.53,-2.75; 26 3.53,-2.25; 27 3.53,-1.75; 28 3.53,-1.25; 29 3.53,-0.75; 30 3.53,-0.25; 31 3.53,0.25; 32 3.53,0.75; 33 3.53,1.25; 34 3.53,1.75; 35 3.53,2.25; 36 3.53,2.75 | smd 0.26 x 0.86: 13 -2.75,-3.53; 14 -2.25,-3.53; 15 -1.75,-3.53; 16 -1.25,-3.53; 17 -0.75,-3.53; 18 -0.25,-3.53; 19 0.25,-3.53; 20 0.75,-3.53; 21 1.25,-3.53; 22 1.75,-3.53; 23 2.25,-3.53; 24 2.75,-3.53; 37 2.75,3.53; 38 2.25,3.53; 39 1.75,3.53; 40 1.25,3.53; 41 0.75,3.53; 42 0.25,3.53; 43 -0.25,3.53; 44 -0.75,3.53; 45 -1.25,3.53; 46 -1.75,3.53; 47 -2.25,3.53; 48 -2.75,3.53 | smd 5.15 x 5.15: 49 0,0
WSOIC8 = smd 0.6 x 2.2: 1 -1.905,-3.33; 2 -0.635,-3.33; 3 0.635,-3.33; 4 1.905,-3.33; 5 1.905,3.33; 6 0.635,3.33; 7 -0.635,3.33; 8 -1.905,3.33
SC70-5 = smd 0.4 x 0.75: 1 -0.65,-1; 2 0,-1; 3 0.65,-1; 4 0.65,1; 5 -0.65,1
QFN20 = smd 0.6 x 0.2: 1 -1.5,1; 6 -1.5,-1; 13 1.5,-1; 18 1.5,1 | smd 0.64 x 0.2: 2 -1.48,0.6; 3 -1.48,0.2; 4 -1.48,-0.2; 5 -1.48,-0.6; 14 1.48,-0.6; 15 1.48,-0.2; 16 1.48,0.2; 17 1.48,0.6 | smd 0.2 x 0.6: 7 -1,-1.5; 12 1,-1.5; 19 1,1.5; 24 -1,1.5 | smd 0.2 x 0.64: 8 -0.6,-1.48; 9 -0.2,-1.48; 10 0.2,-1.48; 11 0.6,-1.48; 20 0.6,1.48; 21 0.2,1.48; 22 -0.2,1.48; 23 -0.6,1.48
VSSOP8 = smd 0.75 x 0.25: 1 -1.55,0.75; 2 -1.55,0.25; 3 -1.55,-0.25; 4 -1.55,-0.75; 5 1.55,-0.75; 6 1.55,-0.25; 7 1.55,0.25; 8 1.55,0.75
VSSOP10 = smd 1.45 x 0.3: 1 -2.2,1; 2 -2.2,0.5; 3 -2.2,0; 4 -2.2,-0.5; 5 -2.2,-1; 6 2.2,-1; 7 2.2,-0.5; 8 2.2,0; 9 2.2,0.5; 10 2.2,1
QFN44 = smd 0.85 x 0.35: 1 -4,3.25; 2 -4,2.6; 3 -4,1.95; 4 -4,1.3; 5 -4,0.65; 6 -4,0; 7 -4,-0.65; 8 -4,-1.3; 9 -4,-1.95; 10 -4,-2.6; 11 -4,-3.25; 23 4,-3.25; 24 4,-2.6; 25 4,-1.95; 26 4,-1.3; 27 4,-0.65; 28 4,0; 29 4,0.65; 30 4,1.3; 31 4,1.95; 32 4,2.6; 33 4,3.25 | smd 0.35 x 0.85: 12 -3.25,-4; 13 -2.6,-4; 14 -1.95,-4; 15 -1.3,-4; 16 -0.65,-4; 17 0,-4; 18 0.65,-4; 19 1.3,-4; 20 1.95,-4; 21 2.6,-4; 22 3.25,-4; 34 3.25,4; 35 2.6,4; 36 1.95,4; 37 1.3,4; 38 0.65,4; 39 0,4; 40 -0.65,4; 41 -1.3,4; 42 -1.95,4; 43 -2.6,4; 44 -3.25,4 | smd 6.6 x 6.6: 45 0,0
4-SMD-3225 = smd 1.4 x 1.15: 1 -1.1,0.8; 2 1.1,0.8; 3 1.1,-0.8; 4 -1.1,-0.8
2-SMD-3215 = smd 1.2 x 1.8: 1 -1.35,0; 2 1.35,0

### Placement (x,y rotation side)
A1  30.25,10.75 0 bottom
C1  29.6,52.1 270 bottom
C2  32.6,50.6 180 bottom
C3  3.7,40.1 270 bottom
C4  25.35,52.1 90 bottom
C5  4.9,40.1 270 bottom
C6  36.65,53.08 180 bottom
C7  8.1,44.9 90 bottom
C8  6.5,35.3 90 bottom
C9  10.5,44.9 90 bottom
C10  11.7,35.3 270 bottom
C11  9.3,44.9 90 bottom
C12  10.5,35.3 270 bottom
C13  36.65,54.33 180 bottom
C14  25.35,56.1 270 bottom
C15  32.6,57.6 180 bottom
C16  29.6,56.1 90 bottom
C17  7.9,34.9 270 bottom
C18  9.85,54 180 bottom
C19  9,46.85 180 bottom
C20  5.2,58.9 270 bottom
C21  8.45,62.05 90 bottom
C22  22,6.25 0 bottom
C23  27.3,44.2 180 bottom
C24  22.5,8 270 bottom
C25  30.23,42.4 90 bottom
C26  22.5,10.25 270 bottom
C27  13.05,23.38 0 bottom
C28  13.55,27.82 0 bottom
C29  29.43,26.55 180 bottom
C30  23,14.25 180 bottom
C31  25.68,32.55 90 bottom
C32  26.15,30.43 180 bottom
C33  23.15,18.25 90 bottom
C34  21.35,20 180 bottom
C35  25.5,19.5 270 bottom
C36  23.52,35.27 270 bottom
C37  29.43,25.3 180 bottom
C38  28.43,22.82 180 bottom
C39  13.15,29.23 0 bottom
C40  12.3,21.3 90 bottom
C41  32.6,20.27 0 bottom
C42  15.43,18.2 45 bottom
C43  17.68,15.85 225 bottom
C44  32.6,25.77 180 bottom
C45  21.25,72.85 180 bottom
C46  18.75,72.85 0 bottom
C47  23.25,70 270 bottom
C48  17.4,63 90 bottom
C49  1.4,19.8 270 bottom
C50  3.15,28.8 180 bottom
C51  9.7,66.95 0 bottom
C52  14.25,44.9 90 bottom
C53  21,159.3 180 bottom
C54  9.4,157.5 0 bottom
C55  27.9,63.8 180 bottom
C56  30.1,45.95 180 bottom
C57  24.25,77.25 225 bottom
C58  24.9,86.6 225 bottom
C59  14.5,86.5 45 bottom
C60  14.5,79 45 bottom
C61  20,44.5 0 bottom
C62  5.5,157.5 180 bottom
E1  22.5,5.25 180 bottom
F1  3.35,59.3 90 bottom
JP1  36.95,24.45 180 bottom
JP2  36.95,27.25 180 bottom
JP3  33.3,42.4 90 bottom
L1  27.45,51.95 90 bottom
L2  27.45,56.25 270 bottom
L3  26.5,41.75 270 bottom
L4  22.5,12.5 90 bottom
L5  22.5,16 90 bottom
L6  21.85,18.25 90 bottom
L7  23.65,20 0 bottom
L8  20.73,35.62 180 bottom
LOGO1  28.9,71.6 90 bottom
M1  20,48 180 bottom
MAT-X1  30.2,124.4 180 top
MAT-X2  23.4,124.4 180 top
MAT-X3  16.6,124.4 180 top
MAT-X4  9.8,124.4 180 top
MAT-Y1  20.02,97.22 180 top
MAT-Y2  20.02,104.03 180 top
MAT-Y3  20.02,110.83 180 top
MAT-Y4  20.02,117.62 180 top
MAT-Y5  20.02,124.42 180 top
MAT-Y6  20.02,131.25 180 top
MAT-Y7  20.02,138.03 180 top
MAT-Y8  20.02,144.82 180 top
MAT-Y9  20.02,151.62 180 top
P1  3.5,35.9 180 bottom
P2  3.5,54.2 0 bottom
P3  3.5,15.75 0 bottom
P4  25.15,158.05 270 bottom
R1  6.2,21.4 270 bottom
R2  36.17,51.25 270 bottom
R3  37.42,51.25 90 bottom
R4  32.2,49.1 0 bottom
R5  32.2,59.1 0 bottom
R6  36.65,55.58 180 bottom
R7  36.08,57.35 270 bottom
R8  37.33,57.35 90 bottom
R9  14.5,40.75 0 bottom
R10  11.7,44.9 90 bottom
R11  12.9,35.3 270 bottom
R12  11.1,32.6 90 bottom
R13  9.3,35.3 90 bottom
R14  14.1,35.3 90 bottom
R15  7.65,55.2 0 bottom
R16  9.85,55.2 0 bottom
R17  6.5,60.8 90 bottom
R18  11.4,58.6 0 bottom
R19  7.7,56.5 180 bottom
R20  31.48,42.4 90 bottom
R21  12.28,7.17 270 bottom
R22  23.25,62.4 180 bottom
R23  23.25,61.15 180 bottom
R24  11.03,7.17 270 bottom
R25  11.1,21.3 90 bottom
R26  23.25,63.75 180 bottom
R27  23.25,65 180 bottom
R28  17.4,60.5 270 bottom
R29  8.5,80 30 top
R30  9.7,65.7 180 bottom
R31  8.5,60 30 top
R32  13,44.9 270 bottom
R33  31.5,80 330 top
R34  27.9,65.05 0 bottom
R35  31.5,60 330 top
R36  30.1,47.2 0 bottom
R37  15.5,87.5 45 bottom
R38  6.3,26.3 270 bottom
SCL  21.7,76.2 90 bottom
SDA  18.1,76.3 90 bottom
TC1  32.85,34.5 90 bottom
U1  32.6,54.1 180 bottom
U2  BQ51050B  [VQFN20']  10,40 270 bottom
U3  8.05,58.4 180 bottom
U5  20,26.12 90 bottom
U6  10.43,14.25 0 bottom
U7  25,73 270 bottom
U8  20,70 180 bottom
U9  20,63 270 bottom
U10  3.25,24 270 bottom
U11  16.5,158.2 180 bottom
U12  20,82.5 135 bottom
U$1  [G0825001]  5,5 170 bottom
U$2  [G0825001]  35,155 102.5 bottom
U$3  [DESIGNEDINPT]  3,75 90 bottom
X1  32.27,23.2 90 bottom
X2  17.93,18.4 225 bottom

### Tracks (layer width: path | path; a pad name or v marks a point on that pad's centre or on a via)
1.8V  (via drill 0.3, 0.3 pad 0.75)
  Top 0.2: v24.09,70.51 24.09,71.91 23.5,72.5 20.45,72.5 v19.25,73.7
  Top 0.305: v27.5,59.5 35.3,59.5 v36,58.8
  Bottom 0.2: U1.10 33.4,56.1 35.16,57.86 R7.1 | U8.13 22.76,71 C47.1 | U8.8 19.4,72.71 C46.1 v19.26,73.69 v19.25,73.7
  Bottom 0.254: U9.2 19.75,63.75 20.4,63.1 23.5,63.1 23.76,63.36 R26.2
  Bottom 0.305: v36,58.8 36.08,58.73 R7.1
  Bottom 0.508: C14.P$1 25.69,57.27 L2.1 27.45,59.45 v27.5,59.5 27.5,61.2 24.95,63.75 | 24.95,63.75 R26.2 R27.2 | 24.95,63.75 24.95,69.65 v24.09,70.51 C47.1
1V8_PG  (via drill 0.3, 0.3 pad 0.75)
  Top 0.2: v35.05,55.05 36.15,53.95 36.15,45.65 27.1,36.6 27.1,32.85 v28.2,31.75 | v27,28.3 v28.8,28.3
  Bottom 0.2: U1.12 34.85,54.85 v35.05,55.05 35.58,55.58 R6.1 | U5.41 24.99,26.88 26.41,28.3 v27,28.3 | v28.2,31.75 28.8,31.15 v28.8,28.3
3.3V  (via drill 0.3, 0.3 pad 0.6, 0.3 pad 0.75)
  Top 0.2: v11.1,22.8 10.8,23.1 6.9,23.1 6.2,22.4 v6.2,19.9
  Top 0.406: R33.1 22.22,65.73 21.84,65.36 | v20,43.7 20,44.2 | R31.2 17.78,47.42 15.4,49.8 12.3,49.8 11.3,48.8 11.3,46.7 v11.5,46.5 | 28.4,69.3 28.3,69.2 28.3,64 25.5,61.2 v25,61.2
  Top 0.61: 33.07,49.1 v27.4,49.1 24.79,49.1 R35.1 22.22,45.82 20.6,44.2 20,44.2 19.4,44.2 17.78,45.82 R31.2 | 33.07,49.1 v34.71,50.74 33.9,51.55 33.9,55.34 34.76,56.2 v38.5,56.2 38.5,64.4 v33.6,69.3 28.4,69.3 24.99,69.3 R33.1 | R29.2 17.78,65.72 19.2,64.3 20.79,64.3 21.84,65.36 | v14,85.3 16.3,87.6 v25.4,87.6 27.1,85.9 v27.1,75.8 v24.9,78 | 33.07,49.1 34.8,47.37 v34.8,46.3 | v36.05,20.5 20.7,20.5 v14.3,14.1
  Bottom 0.152: 16.36,86.14 C59.1
  Bottom 0.2: U1.17 v34.71,50.74 R2.2 | C58.1 | C58.1 | R25.2 v11.1,22.8 | v6.2,19.9 R1.2 6.9,21.59 6.9,23.8 6.3,24.4 R38.2
  Bottom 0.305: v38.5,56.2 37.88,55.58 R6.2 | v27.1,75.8 27.1,72.8 26.65,72.35 U7.3 | U12.40 23.89,77.69 C57.1 | U12.17 16.36,86.14 16.26,86.24 14.94,86.24 | R37.2 14.99,87.71 14.99,86.29 14.94,86.24 | 14.94,86.24 14.84,86.14 | R25.2 12.12,20.79 C40.1 | 38.8,31.1 38,31.1 36,29.1 33.1,29.1 31.9,30.3 31.9,31.64 TC1.1 | U12.28 24.46,86.96 C58.1 | C58.1 25.18,87.6 v25.4,87.6
  Bottom 0.406: v14,85.3 14.84,86.14 C59.1 | C57.1 24.28,78 v24.9,78 | v20,43.7 20.51,44.21 C61.1 20.51,45.6 M1.5 | v11.5,46.5 11.7,46.3 R10.2 | v25,61.2 24.95,61.15 R23.2 | R23.2 R22.2 | R23.2 23.76,59.66 22.35,58.25 18.85,58.25 17.4,59.7 R28.2
  Bottom 0.508: L1.1 25.69,50.93 C4.P$1
  Bottom 0.61: L1.1 27.45,49.15 v27.4,49.1 27.4,46.3 26.48,45.38 C23.P$1 26.5,44.18 L3.1 | v34.8,46.3 38.8,42.3 38.8,31.1 38.8,23.25 v36.05,20.5 | R24.2 R21.2 12.87,6.67 14.3,8.1 v14.3,14.1 12.33,16.07 U6.8 12.33,20.76 C40.1 | v33.6,69.3 v27.1,75.8
!QI_CHG  (via drill 0.3)
  Top 0.2: v11.25,43.05 12.1,42.2 12.1,40.7 15.45,37.35 15.45,26.98 v15.23,26.98
  Bottom 0.2: U2.7 10.75,42.55 v11.25,43.05 11.7,43.5 R10.1 | U5.19 15.84,26.38 v15.23,26.98
DBG_RX  (via drill 0.3)
  Top 0.2: v26.3,27.1 26.83,27.63 34.77,27.63 v35.1,27.3
  Bottom 0.2: U5.42 25.31,26.38 26.02,27.08 26.25,27.08 26.27,27.1 v26.3,27.1 | v35.1,27.3 35.15,27.25 JP2.1
DBG_TX  (via drill 0.3)
  Top 0.203: v26.9,26.5 26.9,26.8 27.4,27.3 32.3,27.3 v35,24.6
  Bottom 0.2: U5.43 25.57,25.88 26.1,26.4 26.8,26.4 v26.9,26.5
  Bottom 0.203: v35,24.6 35.15,24.45 JP1.1
FLASH_CS  (via drill 0.3)
  Top 0.2: v18.9,21.2 12.3,14.6 v12.3,12.9
  Bottom 0.2: U5.9 18.75,21.35 v18.9,21.2 | v12.3,12.9 12.33,12.87 U6.1 12.28,10.87 R21.1
FLASH_MISO  (via drill 0.3)
  Top 0.2: v13.7,20.3 11.1,17.7 v11.1,12.9
  Bottom 0.2: U5.11 17.75,21.85 16.97,21.07 14.5,21.07 13.73,20.3 v13.7,20.3 | v11.1,12.9 11.06,12.86 U6.2
FLASH_MOSI  (via drill 0.3)
  Top 0.2: v13.7,21.4 10.4,21.4 v8.5,19.5
  Bottom 0.2: U5.12 17.25,21.95 16.7,21.4 v13.7,21.4 | v8.5,19.5 8.5,17.6 U6.5
FLASH_SCK  (via drill 0.3)
  Top 0.2: v18,21.2 18,21.15 11.7,14.85 v11.7,13.75
  Bottom 0.2: U5.10 18.25,21.55 18,21.3 v18,21.2 | v11.7,13.75 11.5,13.75 9.79,15.46 U6.6
FSR_1  (via drill 0.3)
  Top 0.2: R29.1 18.86,61.9 21.55,61.9 22.65,60.8 v22.65,57 | v21.6,42 21.6,41.94 23,40.54 23,32.05 24.1,30.95 v24.1,29.8
  Top 0.406: R29.1 13.76,67 v11.4,67
  Bottom 0.2: v22.65,57 23.12,56.53 23.12,43.52 v21.6,42 | v24.1,29.8 23.53,29.23 U5.37
  Bottom 0.406: R30.2 C51.1 11.35,66.95 v11.4,67
FSR_2  (via drill 0.3)
  Top 0.2: R31.1 18.11,42.65 21.85,42.65 23.37,41.13 23.37,32.28 24.7,30.95 v24.7,29.1
  Top 0.406: R31.1 15.52,44.52 v14.3,43.3
  Bottom 0.2: v24.7,29.1 24.7,28.9 24.18,28.38 U5.38
  Bottom 0.406: v14.3,43.3 14.25,43.35 C52.1 R32.2
FSR_3  (via drill 0.3)
  Top 0.2: R33.2 23.35,64.11 23.35,57.2 v23.55,57 | v25.6,29.09 25.6,30.66 23.75,32.51 23.75,41.85 v23.7,41.9
  Top 0.406: R33.2 26.02,65.23 v26.25,65
  Bottom 0.2: v23.55,57 23.55,42.05 v23.7,41.9 | v25.6,29.09 25.6,29.05 24.43,27.88 U5.39
  Bottom 0.406: v26.25,65 26.3,65.05 R34.2 C55.1
FSR_4  (via drill 0.3)
  Top 0.2: R35.2 24.48,41.48 24.13,41.13 24.13,32.75 26.45,30.43 26.45,29.15 v26.5,29.1
  Top 0.406: R35.2 26.44,47.2 v28.7,47.2
  Bottom 0.2: v26.5,29.1 26.45,29.1 24.73,27.38 U5.40
  Bottom 0.406: v28.7,47.2 R36.2 C56.1
GBAT
  Bottom 0.2: C20.2 5.38,58.58 U3.2
  Bottom 0.406: U3.2 U3.1
  Bottom 0.61: U3.1 5.67,57.02 | R19.1 6.2,56.5 5.67,57.02 | P2.1 4.55,55.9 5.67,57.02
GND  (via drill 0.3, 0.3 pad 0.6, 0.35)
  Top 0.6: 0.55,89 0.55,157.32 2.33,159.1 7.45,159.1 | 7.45,159.1 12,159.1 | v7.45,158.23 7.45,159.1 | v12.25,158.85 12.7,158.4 15.75,158.4 16.35,159 20,159 | 20,159 21,158 v22.45,158 | 20,159 20.4,159.4 v22.45,159.4
  Top 0.61: 0.55,89 0.55,87 | 12,159.1 v12.25,158.85
  Top 1.27: v36,90 36,87.5
  Bottom 0.2: C58.2 25.06,86.04 24.49,86.04 v24.25,85.8 24.22,85.8 U12.29
  Bottom 0.254: U1.5 31.85,54.85 U1.21 32.55,54.05 | U1.2 31.85,53.35 32.35,53.85 | U1.19 32.35,53.85 | 32.35,53.85 32.55,54.05 | U1.8 32.35,54.25 32.55,54.05 | U2.25@5 8.06,39.75 U2.25@2 | U2.25@6 8.06,40.25 U2.25@2 | U2.25@2 U2.25@0 U2.25@1 | U2.25@3 11.94,40.25 U2.25@1 | U2.25@4 11.94,39.75 U2.25@1
  Bottom 0.305: U12.29 22.2,83.78 v22.2,83.6 | U11.8 22.25,158.2 v22.45,158 | U11.4 12.4,158.7 v12.25,158.85
  Bottom 0.406: 7.5,158.23 v7.45,158.23 | C53.2 22.35,159.3 v22.45,159.4
  Bottom 0.6: C54.P$2 7.85,158.23 7.5,158.23 7.05,158.23 C62.P$2
  Bottom 1.27: v36,90 36,86.5
  other vias: 33.48,33.23 21.8,28 20,28 18.2,28 21.8,26.1 20,26.1 18.2,26.1 21.8,24.2 20,24.2 18.2,24.2 32.6,53.4 32.6,54.8 11,39.5 23.3,82.5 21.1,84.7 20,85.8 18.9,84.7 20,83.6 21.1,82.5 22.2,81.4 21.1,80.3 20,79.2 18.9,80.3 17.8,81.4 16.7,82.5 18.9,82.5 20,81.4 10,40.5 9,39.5 20.45,69.6 22.35,70.3 21.15,67.5 23.55,66.2 20.6,74.5 19.3,62.6 18.6,63.3 18.55,60.75 21.5,59.1 27.2,30.4 32.2,34.45 24.95,34.7 21.45,37.2 20.05,37.2 21.45,40.05 20.1,40.05 29,41.4 29,42.4 28,42.4 28,41.4 32.2,28.5 31.2,28.5 30.2,28.5 19.55,70.45 17.8,83.6 33,68 34,67 35,66 36,65 37,64 20.5,11.5 35,70 36,69 37,68 38,67 39,66 29.5,75.5 30.5,74.5 31.5,73.5 32.5,72.5 33.5,71.5 28.5,72.5 29.5,71.5 30.5,70.5 28.5,79.5 28.5,78 28.5,81 28.5,82.5 26,82.5 26,81 26,79.5 39,69.5 39,71 39,72.5 39,74 39,75.5 39,77 39,78.5 39,80 39,81.5 39,83 39,84.5 39,86 38,87.5 36.5,87.5 35,87.5 33.5,87.5 13,81.5 14,82.5 10.5,82.5 11.5,83.5 12.5,84.5 4.5,86.5 5.5,85.5 6.5,84.5 7.5,83.5 8.5,82.5 4,82 5,81 6,80 3,80 3,78.5 3,77 3,75.5 9,74.5 10,73.5 11,72.5 12,71.5 13,70.5 12,78 13,77 14,76 15,75 3,74 3,72.5 3,71 3,69.5 3,68 3,66.5 3,65 3,63.5 27,66 27,67.5 29.5,67.5 29.5,66 29.5,64.5 21.5,57 20,57 18.5,57 18.5,54 20,54 21.5,54 18.5,51 20,51 21.5,51 3,42 4,43 5,44 6,45 3,46 4,47 5,48 2.3,48 2.3,49.5 1.2,52.7 1.2,54.2 1.2,55.7 5,32 6.5,32 8,32 9.5,32 7.8,25.9 9,25.9 10.2,25.9 11.4,25.9 7.8,22.1 9,22.1 1,17.5 1,16 1,14.5 1,13 1,11.5 1,10 1,8.5 1.5,6.5 3,6.5 4.5,6.5 6,6.5 7.5,6.5 9,6.5 15,6.5 16.5,6.5 18,6.5 20.5,8.5 20.5,10 20.5,13 19,14.5 20,15.5 21,16.5 16,13.5 17,14.5 25,17 25,15.5 25,14 25,12.5 25,9 24.5,6.5 26,6.5 27.5,6.5 29,6.5 30.5,6.5 32,6.5 33.5,6.5 35,6.5 36.5,6.5 38,6.5 39,7.5 39,9 39,10.5 39,12 39,13.5 39,15 39,16.5 39,18 37.5,20 38.5,21 35,21.5 36,22.5 37,46 37,47.5 37,49 37,61 37,62.5 37.5,37.5 37.5,36 6.5,16.5 6.5,15 6.5,13.5 6.5,12 9.5,52 9.5,50.5 9.5,49 12.75,64.5 12.75,63 12.75,61.5 12.75,60 37,42.5 36,43.5 14,19 15,20 26,60 25,59 31,26.5 30.2,34 29.2,34 12.1,53.9 13.6,53.9 12,56.8 13.5,56.8 6.1,65 6.1,63.5 12.1,51.1 13.6,51.1 1.2,57.2
  pour Bottom (isolate 0.15): 41,88.5 -1,88.5 -1,5.25 41,5.25
  pour Top (isolate 0.15): 42,88.5 -2,88.5 -2,5.25 42,5.25
  pour Bottom (isolate 0.3): 2.5,89 2.5,156.6 37,156.6 37,89 34.2,89 34.2,155.6 5.8,155.6 5.8,89
  pour Top (isolate 0.5): 2.5,89 2.5,156.6 37,156.6 37,89
I2S_CLK  (via drill 0.3)
  Top 0.2: v18.4,34.7 18.35,34.75 18.35,37.5 18.67,37.82 18.67,40.97 v19.7,42
  Bottom 0.2: U5.31 20.25,31.95 18.9,33.3 18.9,34.2 v18.4,34.7 | M1.4 21.55,46.75 22.1,46.2 22.1,44.4 v19.7,42
I2S_DATIN  (via drill 0.3)
  Top 0.2: v17.91,33.9 17.8,34.01 17.8,37.6 18.2,38 18.2,41.45 v18.75,42
  Bottom 0.2: U5.30 19.75,31.75 18.45,33.05 18.45,33.35 v17.91,33.89 v17.91,33.9 | v18.75,42 17.75,43 17.75,44.51 M1.1
JTAG_TCKC  (via drill 0.3)
  Top 0.2: v25.65,35.9 25.9,36.15 25.9,38.2 v25.7,38.4
  Bottom 0.2: U5.25 17.25,30.32 16.05,31.53 16.05,35.52 19.33,38.8 25.3,38.8 v25.7,38.4 | v25.65,35.9 27.7,35.9 28.7,34.9 31.05,34.9 31.91,35.77 TC1.4
JTAG_TDI  (via drill 0.3)
  Top 0.2: v28.2,36.4 29.7,34.9 31.05,34.9 31.25,35.1 32.9,35.1 v33.5,34.5
  Bottom 0.2: U5.27 18.25,30.5 16.9,31.85 16.9,35.25 19.6,37.95 24.59,37.95 25.74,36.8 27.8,36.8 v28.2,36.4 | v33.5,34.5 TC1.8
JTAG_TDO  (via drill 0.3)
  Top 0.2: v29.76,38.44 30.61,39.29 32.23,39.29 32.84,38.69 32.84,37.69 TC1.6
  Bottom 0.2: U5.26 17.75,30.39 16.47,31.66 16.47,35.38 19.46,38.38 24.77,38.38 25.87,37.28 28.58,37.28 29.7,38.4 29.72,38.4 v29.76,38.44
  other vias: 33.48,37.04
JTAG_TMSC  (via drill 0.3)
  Top 0.2: v25.1,39.7 24.5,39.1 24.5,37.1 v24.75,36.85
  Bottom 0.2: U5.24 16.47,30.49 15.62,31.34 15.62,35.66 19.19,39.23 24.63,39.23 v25.1,39.7 | v24.75,36.85 24.75,35.95 27.45,33.25 32.15,33.25 32.17,33.23 TC1.2
LRA1_EN  (via drill 0.3)
  Top 0.2: v15.2,23.2 14.2,23.2 13.85,23.55 6.35,23.55 v6.2,23.4
  Bottom 0.2: U10.5 4.25,25.35 v6.2,23.4 R1.1 | U5.14 15.88,23.88 v15.2,23.2
LRA2_EN  (via drill 0.3 pad 0.6)
  Top 0.2: v13.7,25.7 13.6,25.7 12.8,24.9 7,24.9 6.3,25.6 v6.3,27.7 6.3,28.9 4.4,30.8 v3.1,30.8
  Bottom 0.2: U11.5 12.9,159.2 12.4,159.7 3,159.7 2.67,159.67 0.4,157.4 0.4,51.1 1.5,50 1.5,44.9 0.4,43.8 0.4,33.55 3.12,30.82 v3.1,30.8 | R38.1 v6.3,27.7 | U5.17 15.05,25.38 14.74,25.68 13.7,25.68 v13.7,25.7
MCU_!RESET  (via drill 0.3)
  Top 0.2: v22.4,30.7 22.3,30.8 | v22.4,30.7 22.2,30.9 | v22.4,30.7 21.95,31.15 v21.95,32.15 | v31.25,32.5 v34.7,32.5 36.6,32.5 38.4,34.3 38.4,38.7 36.4,40.7 v33.3,40.7
  Bottom 0.2: U5.35 22.25,30.55 v22.4,30.7 | v34.7,32.5 34.16,31.96 TC1.10 | v31.25,32.5 25.1,32.5 24.75,32.15 v21.95,32.15 | v33.3,40.7 JP3.1
  Bottom 0.406: 31.41,41.83 R20.1 | JP3.1 R20.1 | R20.1 C25.1
MCU_SW
  Bottom 0.254: U5.33 21.25,31.4
  Bottom 0.406: 21.25,31.4 21.25,32.95 19.71,34.49 L8.1
MPU_INT  (via drill 0.3)
  Top 0.2: v23.1,71.6 18.1,71.6 v16.9,70.4 | v20.1,41.15 19.1,40.15 19.1,34.05 19.67,33.48 v19.67,33.45
  Bottom 0.2: U7.4 23.85,72.35 v23.1,71.6 | v16.9,70.4 16.25,69.75 16.25,59 17.35,57.9 17.35,42.55 18.75,41.15 v20.1,41.15 | v19.67,33.45 20.75,32.37 U5.32
MPU_PWR
  Bottom 0.305: R5.1 32.6,58.99 32.6,56.9 32.85,56.65 U1.9
N$1
  Bottom 0.254: U5.2 22.25,21.25 21.86,20.86 C34.2
  Bottom 0.61: C34.2 L6.2
N$2
  Bottom 0.254: U5.23 14.92,28.38 14.07,29.23 C39.P$1
N$3
  Bottom 0.2: L7.2 23.1,20.04
  Bottom 0.254: U5.1 22.75,21.25 23.1,20.9 23.1,20.04
  Bottom 0.61: L7.2 C33.2
N$4
  Bottom 0.2: U8.12 22,71.5 23.5,73 U7.2
N$5
  Bottom 0.2: R26.1 20.55,63.75 20.25,64.05 U9.3 20.25,65.85 19.4,66.7 U8.23
N$6  (via drill 0.3)
  Top 0.2: v18.7,67.6 19.6,67.6 v20.1,67.1
  Bottom 0.2: R27.1 21.9,65 21.45,64.55 U9.4 20.75,66.45 v20.1,67.1 | U8.24 19,67.9 v18.7,67.6
N$7
  Bottom 0.2: U6.3 9.79,8.31 10.42,7.68 R24.1
N$8
  Bottom 0.2: U6.7 11.06,20.75 R25.1
N$9
  Bottom 0.2: U8.10 20.2,72.31 C45.1
N$10
  Bottom 0.305: U12.7 15.08,78.5 C60.P$1
N$11
  Bottom 0.254: R28.1 17.84,61.45 | 17.84,61.45 17.69,61.45 17.4,61.74 C48.1 | 17.84,61.45 U9.8 U9.7
N$12
  Bottom 0.61: C26.1 L4.1
N$13
  Bottom 0.61: C24.1 C26.3
N$14
  Bottom 0.61: C35.1 L7.1
N$15
  Bottom 0.61: L5.2 22.5,16.99 22.55,17.04 22.5,17.09 | 22.5,17.09 L6.1 | C33.1 22.5,17.09
N$16
  Bottom 0.61: L4.2 C30.1 L5.1
N$17
  Bottom 0.508: E1.ANT C22.1
  Bottom 0.61: C22.1 C24.2
N$18
  Bottom 0.61: C26.2 28.72,10.76 A1.P$3
N$19  (via drill 0.3)
  Top 0.2: v36.5,34.6 34.75,34.6 32.31,37.04 TC1.5 | v37.8,28.9 v37.8,32.7 37.8,32.8
  Bottom 0.2: JP2.2 37.46,28.15 37.8,28.49 v37.8,28.9 | v37.8,32.7 37.8,33.3 v36.5,34.6
  other vias: 32.22,37.04
N$20  (via drill 0.3)
  Top 0.2: v36.8,31.9 37.1,31.6 37.1,26.1 v37.5,25.7
  Bottom 0.2: TC1.7 33.59,35.77 34.76,34.6 35.3,34.6 36.8,33.1 v36.8,31.9 | v37.5,25.7 37.5,24.49 JP1.2
N$21
  Bottom 0.2: U3.5 10.87,58.58 R18.2
N$22
  Bottom 0.61: P2.2 2.45,57.44 F1.1
N$23
  Bottom 0.2: C20.1 5.43,59.17 U3.3 6.45,60.24 R17.1
N$25
  Bottom 0.2: U1.16 34.1,52.4 34.74,51.76 R2.1
  Bottom 0.406: R2.1 R3.2
N$26
  Bottom 0.305: U1.18 32.85,51.45 32.6,51.2 32.6,49.21 R4.1
N$27
  Bottom 0.305: U10.7 3.75,19.9 3.75,18.85 4.3,18.3 4.3,15.75 P3.1
N$28
  Bottom 0.305: U1.3 28.33,53.85 L1.2
N$29
  Bottom 0.305: U1.14 34.75,53.85 35.52,53.08 C6.1
N$30
  Bottom 0.305: U1.4 28.33,54.35 L2.2
N$31
  Bottom 0.305: U1.13 36.12,54.35 C13.1
N$32
  Bottom 0.2: 36.08,56.77 R7.2 35.04,56.84 34.1,55.9 U1.11
  Bottom 0.406: R7.2 R8.1
N$33
  Bottom 0.305: U10.9 2.75,18.85 2.2,18.3 2.2,15.75 P3.2
N$34
  Bottom 0.305: U11.7 22.8,158.7 23.2,159.1 P4.1
N$35
  Bottom 0.305: U11.9 20.1,157.7 20.8,157 P4.2
N$36
  Bottom 0.305: C50.P$1 2.25,28.72 U10.1
N$37
  Bottom 0.305: C54.P$1 11.17,157.5 11.47,157.2 U11.1
N$39  (via drill 0.3)
  Top 0.508: v12.2,36.7 12.2,33.9 v12.5,33.6
  Bottom 0.254: U2.14 10.75,37.65 11.7,36.7 v12.2,36.7
  Bottom 0.508: R13.1 9.3,34.1 10.29,33.11 R12.2 12.01,33.11 v12.5,33.6 12.9,34 R11.2
N$40  (via drill 0.3)
  Top 0.254: v13.2,36.7 13.2,37.7 v12.7,38.2
  Bottom 0.254: R11.1 12.9,36.4 v13.2,36.7 | v12.7,38.2 12.65,38.25 U2.12
N$41
  Bottom 0.254: U2.18 8.75,37.35 7.9,36.5 C17.P$1
  Bottom 0.508: R13.2 7.99,35.81 C17.P$1
N$42
  Bottom 0.254: U2.10 R9.2
N$43
  Bottom 0.254: U2.5 9.75,43.35 9.3,43.8 C11.1
N$44
  Bottom 0.254: U2.6 10.25,43.35 10.5,43.6 C9.1
N$45
  Bottom 0.254: U2.3 8.75,42.35 8.1,43 C7.1
N$46
  Bottom 0.254: U2.16 9.75,37.35 10.5,36.6 C12.1
N$47
  Bottom 0.254: U2.15 10.25,37.55 11.7,36.1 C10.1
N$48  (via drill 0.3)
  Top 0.508: v9.33,36.87 6.5,34.04 v6.5,34
  Bottom 0.254: v9.33,36.87 9.25,36.95 U2.17
  Bottom 0.508: C8.1 v6.5,34
N$49  (via drill 0.3)
  Top 0.508: v10.5,34 9.7,33.2 v4.5,33.2
  Bottom 0.254: U2.19 8.25,37.75 7.75,37.25 6.5,37.25
  Bottom 0.508: C10.2 C12.2 v10.5,34 | 4.6,35.9 P1.2 | 5.58,38.18 4.9,38.85 C5.2 4.9,38.99 | 5.58,38.18 6.5,37.25 C8.2 | P1.2 4.55,37.15 5.58,38.18 | v4.5,33.2 4.55,33.25 P1.2
N$50
  Bottom 0.254: U2.2 8.25,42.25 7.1,43.4
  Bottom 0.508: C9.2 C11.2 C7.2 7.61,45.41 7.1,44.9 7.1,43.4 4.9,41.2 C5.1 C3.1
N$51
  Bottom 0.508: C3.2 2.45,38.35 P1.1
N$53  (via drill 0.3, 0.3 pad 0.75)
  Top 0.2: v35,52.5 35.82,51.68 35.82,45.82 34.1,44.1 v33.3,44.1
  Bottom 0.2: U1.15 34.55,53.35 35,52.9 v35,52.5 | v33.3,44.1 JP3.2
N$61  (via drill 0.3 pad 0.6)
  other vias: 28.5,19
N$62  (via drill 0.3 pad 0.6)
  other vias: 30,19
N$63  (via drill 0.3 pad 0.6)
  other vias: 31.5,19
N$64  (via drill 0.3 pad 0.6)
  other vias: 33,19
N$65  (via drill 0.3 pad 0.6)
  other vias: 28.5,21.5
PCAP_RX0
  Bottom 0.152: MAT-X1.P$2 30.2,93.62 U12.27
PCAP_RX1
  Bottom 0.152: MAT-X2.P$2 23.4,87.74 U12.26
PCAP_RX2
  Bottom 0.152: MAT-X3.P$2 16.6,94.9 22.5,89 22.5,87.76 U12.25
PCAP_RX3
  Bottom 0.152: MAT-X4.P$2 12.3,92.5 17.5,92.5 21.5,88.5 21.5,87.68 U12.24
PCAP_RX4
  Bottom 0.152: MAT-Y1.P$2 MAT-Y1.P$3 MAT-Y1.P$4 MAT-Y1.P$5 MAT-Y1.P$8 6.03,97.22 5.5,96.7 5.5,93 7,91.5 16.66,91.5 U12.23
PCAP_RX5
  Bottom 0.152: U12.22 16.1,91 6.8,91 5,92.8 5,103 6.03,104.03 MAT-Y2.P$8 MAT-Y2.P$5 MAT-Y2.P$4 MAT-Y2.P$3 MAT-Y2.P$2
PCAP_RX6
  Bottom 0.152: U12.21 15.68,90.5 6.6,90.5 4.5,92.6 4.5,109.3 6.03,110.83 MAT-Y3.P$8 MAT-Y3.P$5 MAT-Y3.P$4 MAT-Y3.P$3 MAT-Y3.P$2
PCAP_RX7
  Bottom 0.152: U12.20 15.26,90 6.4,90 4,92.4 4,115.6 6.03,117.62 MAT-Y4.P$8 MAT-Y4.P$5 MAT-Y4.P$4 MAT-Y4.P$3 MAT-Y4.P$2
PCAP_RX8
  Bottom 0.152: MAT-Y5.P$2 MAT-Y5.P$3 MAT-Y5.P$4 MAT-Y5.P$5 MAT-Y5.P$8 6.03,124.42 3.5,121.9 3.5,92 6,89.5 14.84,89.5 U12.19
PCAP_TX0
  Bottom 0.152: MAT-Y9.P$8 MAT-Y9.P$5 MAT-Y9.P$4 MAT-Y9.P$3 MAT-Y9.P$2 33.92,151.62 36,149.55 36,92.5 27.5,84 26.1,84 U12.33
PCAP_TX1
  Bottom 0.152: MAT-Y8.P$8 MAT-Y8.P$5 MAT-Y8.P$4 MAT-Y8.P$3 MAT-Y8.P$2 33.92,144.82 35.5,143.25 35.5,93 27,84.5 25.68,84.5 U12.32
PCAP_TX2
  Bottom 0.152: MAT-Y7.P$8 MAT-Y7.P$5 MAT-Y7.P$4 MAT-Y7.P$3 MAT-Y7.P$2 33.92,138.03 35,136.95 35,93.5 26.5,85 25.26,85 U12.31
PCAP_TX3
  Bottom 0.152: MAT-Y6.P$8 MAT-Y6.P$5 MAT-Y6.P$4 MAT-Y6.P$3 MAT-Y6.P$2 33.92,131.25 34.5,130.68 34.5,94 26,85.5 24.84,85.5 U12.30
QI_CTRL  (via drill 0.3)
  Top 0.2: v14.45,26.35 14.45,27.15 15.02,27.72 15.02,35.78 v14.1,36.7
  Bottom 0.2: U2.13 11.25,37.75 11.6,37.4 13.4,37.4 v14.1,36.7 R14.2 | U5.18 15.38,25.88 14.9,26.35 v14.45,26.35
SCL  (via drill 0.3)
  Top 0.2: v16.15,58.15 17.67,59.67 19.88,59.67 v20.2,59.35 | v16.58,72.37 16.53,72.37 v15.6,73.3 | v17,41.4 16.33,40.73 16.33,25.93 v14.4,24 5.7,24 v5.1,23.4
  Bottom 0.152: U12.44 20.5,77.34 | U11.2 14.25,157.65
  Bottom 0.2: U11.2 11.84,157.7 10.69,158.85 3,158.85 1.3,157.15 1.3,87.27 15.27,73.3 v15.6,73.3 | R22.1 20.7,62.4 20.25,61.95 U9.6 20.25,59.4 v20.2,59.35 | v17,41.4 15.83,42.57 15.83,57.83 v16.15,58.15 15.83,58.47 15.83,72.02 16.18,72.37 v16.58,72.37 16.58,72.82 20.53,76.77 U12.44 SCL.1 | v14.4,24 14.78,24.38 U5.15 | v5.1,23.4 4.6,23.4 2.75,25.25 U10.2
SDA  (via drill 0.3)
  Top 0.2: v15.15,58.15 17,60 v21.5,60 | v16,41.4 15.9,41.3 15.9,26.5 v14.4,25 13.83,24.43 6.17,24.43 v3,27.6
  Bottom 0.2: U11.3 12,158.2 10.95,159.25 2.8,159.25 0.8,157.25 0.8,87 15.45,72.35 | U9.5 21.65,61.45 21.95,61.15 | 21.95,61.15 R23.1 | v21.5,60 21.95,60.45 21.95,61.15 | 15.45,72.35 15.45,58.45 v15.15,58.15 15.45,57.85 15.45,41.95 v16,41.4 | 15.45,72.35 15.5,72.3 19.47,76.27 U12.1 18.4,76.3 SDA.1 | v14.4,25 14.53,24.88 U5.16 | U10.3 3.25,27.35 v3,27.6
TC_!RESET  (via drill 0.3)
  Top 0.2: v16.71,86.76 7.3,77.35 v7.3,77.3 | v12.3,47.1 12.65,46.75 12.65,41 14.9,38.75 v15.3,38.75 | v17,38.75 16.9,38.65 16.9,32.8 v17.6,32.1
  Bottom 0.2: R37.1 16.33,87.14 v16.71,86.76 17.63,85.84 U12.18 | v7.3,77.3 8.85,77.3 14.45,71.7 14.45,57.75 15.05,57.15 15.05,49.85 v12.3,47.1 | v17,38.75 v15.3,38.75 | v17.6,32.1 18.75,30.95 U5.28
TC_INT  (via drill 0.3)
  Top 0.2: v15.2,80 12,80 v8.2,76.2 | v12.25,48.1 13.03,47.32 13.03,41.34 14.71,39.65 v15.3,39.65 | v17,39.65 17.75,38.9 17.75,38.25 17.33,37.83 17.33,33.3 v17.63,33
  Bottom 0.2: U12.8 15.66,80 v15.2,80 | v8.2,76.2 9.44,76.2 14.07,71.56 14.07,57.52 14.63,56.96 14.63,50.48 v12.25,48.1 | v17,39.65 v15.3,39.65 | v17.63,33 19.25,31.38 U5.29
VBAT  (via drill 0.3, 0.3 pad 0.6, 0.3 pad 0.75, 0.3 pad 0.9, 0.35)
  Top 0.6: v17,158.2 16.25,157.45 v3.5,157.45 2.15,157.45 1.5,156.8 1.5,89
  Top 0.61: v8.9,43.2 8.9,45.7 7.8,46.8 v6.8,46.8 5.9,46.8 1,41.9 1,25.8 v3.2,23.6 | 1.5,89 1.5,62.8 2.1,62.2 v2.1,60.3 2.1,58.4 v7.2,53.3 9.5,53.3 11.75,55.55 22.35,55.55 23.8,54.1 28.6,54.1 | 28.6,54.1 v30.9,51.8 | 28.6,54.1 v30.8,56.3
  Bottom 0.152: U11.6 18.2,159.2
  Bottom 0.2: v7.2,53.3 7.2,55.14 R15.2
  Bottom 0.254: U2.4 9.25,42.85 v8.9,43.2
  Bottom 0.305: U11.10 17.3,157.2 17,157.5 v17,158.2 17,158.9 17.3,159.2 U11.6 20.39,159.2 C53.1 | U10.6 4.25,23.05 3.7,23.6 v3.2,23.6 2.7,23.6 2.25,23.15 U10.10 2.25,20.76 1.8,20.31 C49.1 | C16.P$1 29.67,55.35 U1.6 31.1,56 v30.8,56.3 31,56.1 U1.7 31.85,57.53 C15.P$1 31.78,59.02 R5.2 | C1.P$1 29.67,52.85 U1.1 31.1,52 v30.9,51.8 31.2,52.1 U1.20 31.85,50.67 C2.P$1 31.78,49.19 R4.2
  Bottom 0.6: C62.P$1 4.63,157.45 v3.5,157.45
  Bottom 0.61: v6.8,46.8 6.8,51.27 7.2,51.67 v7.2,53.3 | C21.1 7.92,61.31 R17.2 4.39,61.31 F1.2 2.13,60.27 v2.1,60.3
  Bottom 0.813: C19.P$1 6.85,46.85 v6.8,46.8
VBAT_SNS  (via drill 0.3)
  Top 0.2: v23.3,30.7 23.3,31.14 22.62,31.82 22.62,40.03 v20.65,42 | v22.45,52.1 22.05,52.5 v12.75,52.5
  Bottom 0.2: U5.36 23.3,30.2 v23.3,30.7 | v20.65,42 20.65,42.25 22.7,44.3 22.7,51.85 v22.45,52.1 | 9.4,55.26 R16.2 | C18.1 9.34,53.66 10.5,52.5 v12.75,52.5
  Bottom 0.508: C18.1 R16.2 R15.1
VDDR  (via drill 0.3)
  Top 0.254: v26.48,25.02 26.48,23.58 v25.8,22.9
  Top 0.406: v21.7,34.2 21.7,33.35 21.2,32.85 21.2,30.3 v26.48,25.02
  Bottom 0.254: U5.48 25.32,23.38 v25.8,22.9 25.88,22.82 C38.1 | U5.45 26.33,24.88 v26.48,25.02 26.76,25.3 C37.1
  Bottom 0.406: v21.7,34.2 21.74,34.24 L8.2 22.21,36.1 C36.P$1
  Bottom 0.508: L8.2 21.49,35.88
VDDS  (via drill 0.3)
  Top 0.305: v31.5,43.9 31.5,42.5 28.8,39.8 v26.5,39.8
  Top 0.508: v15.8,22.4 16.2,22.8 23.2,22.8 v23.6,22.4 | v27.9,26.6 27.9,22.95 v27.05,22.1
  Top 0.61: v26.5,39.8 26.5,32.3 v27,31.8
  Bottom 0.254: U5.44 25.93,25.38 26.4,25.85 27.52,25.85 27.9,26.23 v27.9,26.6 | U5.22 14.11,27.88 C28.1 14.06,27.11 13.01,26.06 13.01,25.27 13.56,24.73 C27.1 13.56,23.22 14.38,22.4 v15.8,22.4 16.47,23.07 U5.13 | C31.P$1 22.43,31.73 21.75,31.05 U5.34
  Bottom 0.305: R20.2 31.48,43.88 v31.5,43.9
  Bottom 0.406: C29.1 27.95,26.55 v27.9,26.6 27.9,30.9 v27,31.8
  Bottom 0.508: v27.05,22.1 23.9,22.1 v23.6,22.4
  Bottom 0.61: v27,31.8 26.93,31.73 C31.P$1 25.64,31.69 C32.1 | L3.2 v26.5,39.8
XTAL_32K_Q1
  Bottom 0.2: U5.3 21.75,21.91 20,20.16 20,18.57 X2.2 18.55,17.45 C43.1
XTAL_32K_Q2
  Bottom 0.2: U5.4 21.25,21.95 19.8,20.5 18.12,20.5 X2.1 | 16.97,19.47 X2.1 | C42.1 16.97,19.03 X2.1
XTAL_48M_N
  Bottom 0.254: U5.46 31.4,24.38 X1.3 31.48,25.57 31.68,25.77 C44.1
XTAL_48M_P
  Bottom 0.254: U5.47 29.23,23.88 29.8,23.3 29.8,21.9 30.7,21 33.1,21 | C41.1 33.11,20.99 33.1,21 | 33.1,21 33.1,22.07 X1.1

### Text on the board
tPlace: MIC
bPlace: LRA | HapticControl / V0.1 1920 | 4.2V Lipo | DRX | TDO | TCK | DTX | GND | TDI | QI Coil | TMS | GND | 3V3 | RST | CC2642R | Non TagConnect Compliant | DBG UART | LRA
Measures: R3
Reference: LRA | Mic | LRA